# EAGLE design AK4493-Combi8 (EAGLE 9.6.2)
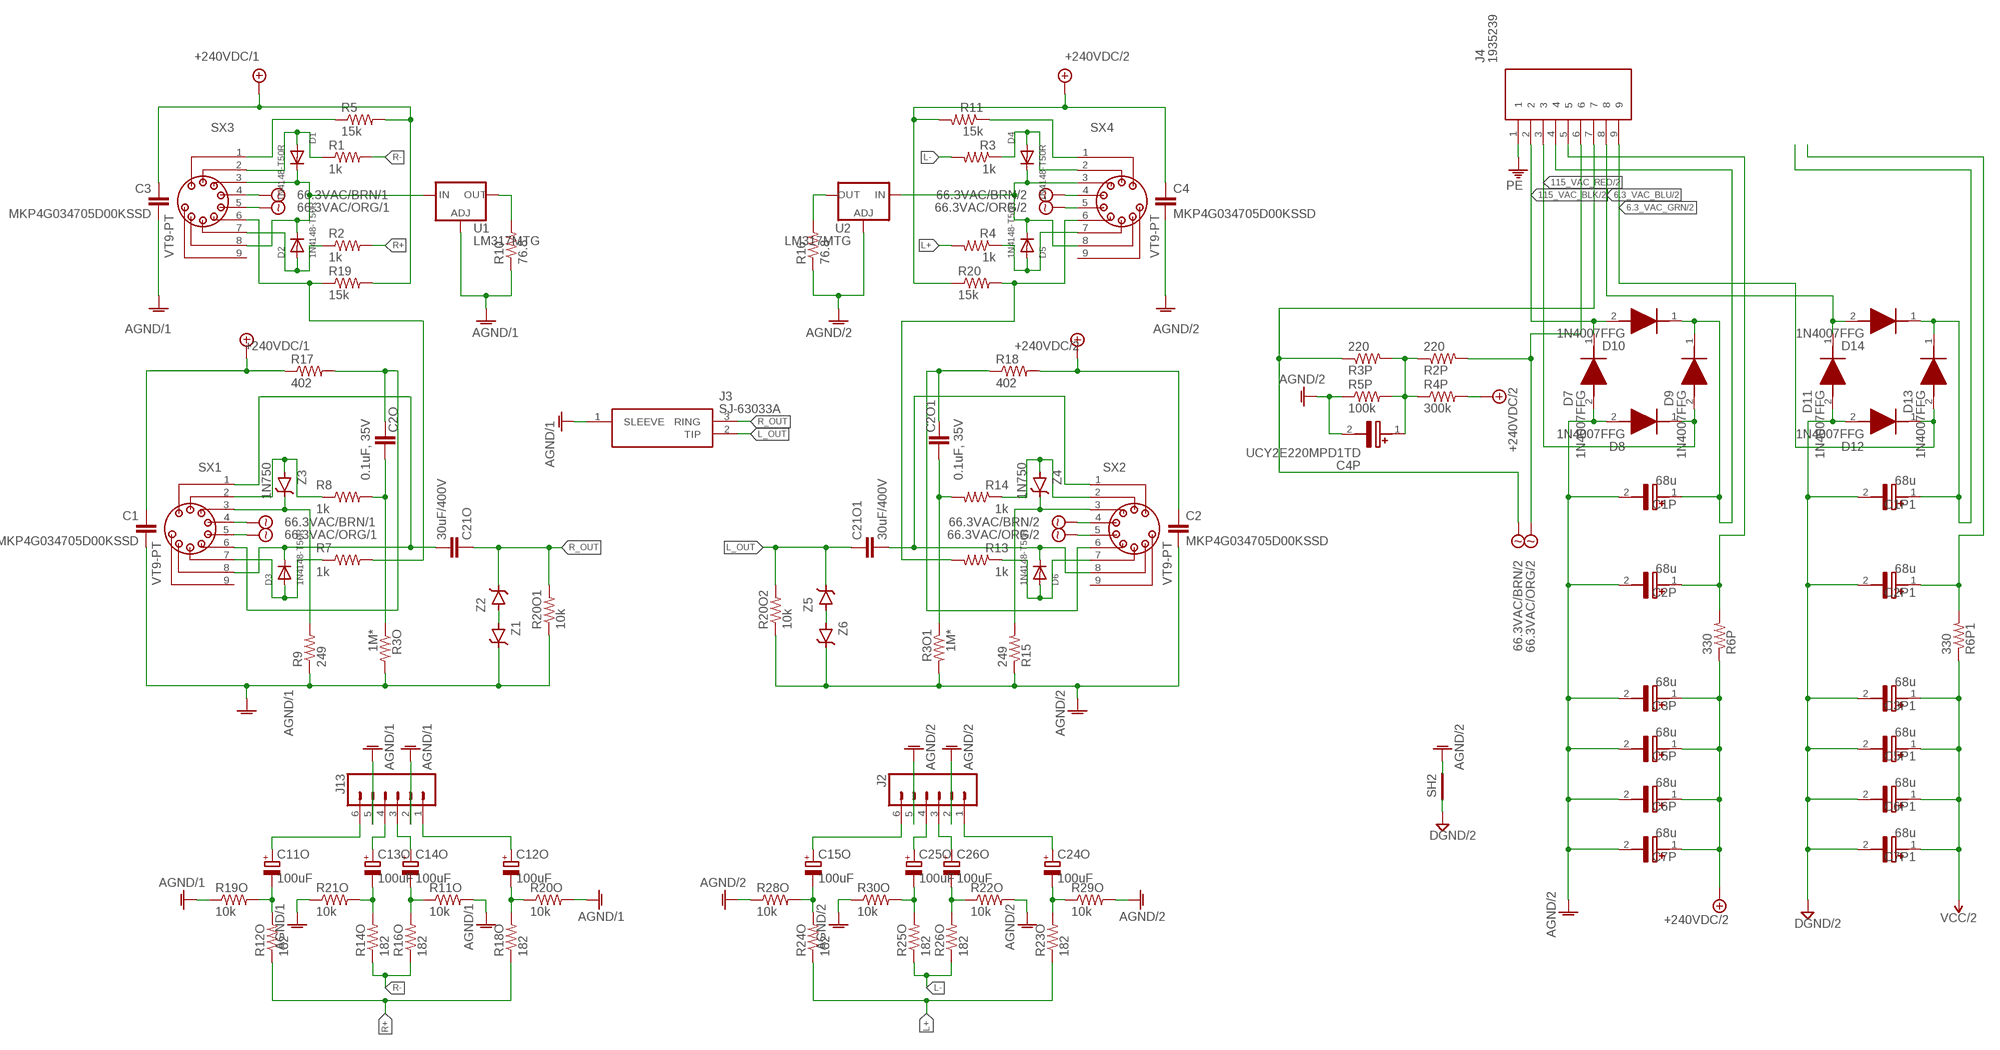
[diagram p0: schematic, sheet 1, part 1 of 2]
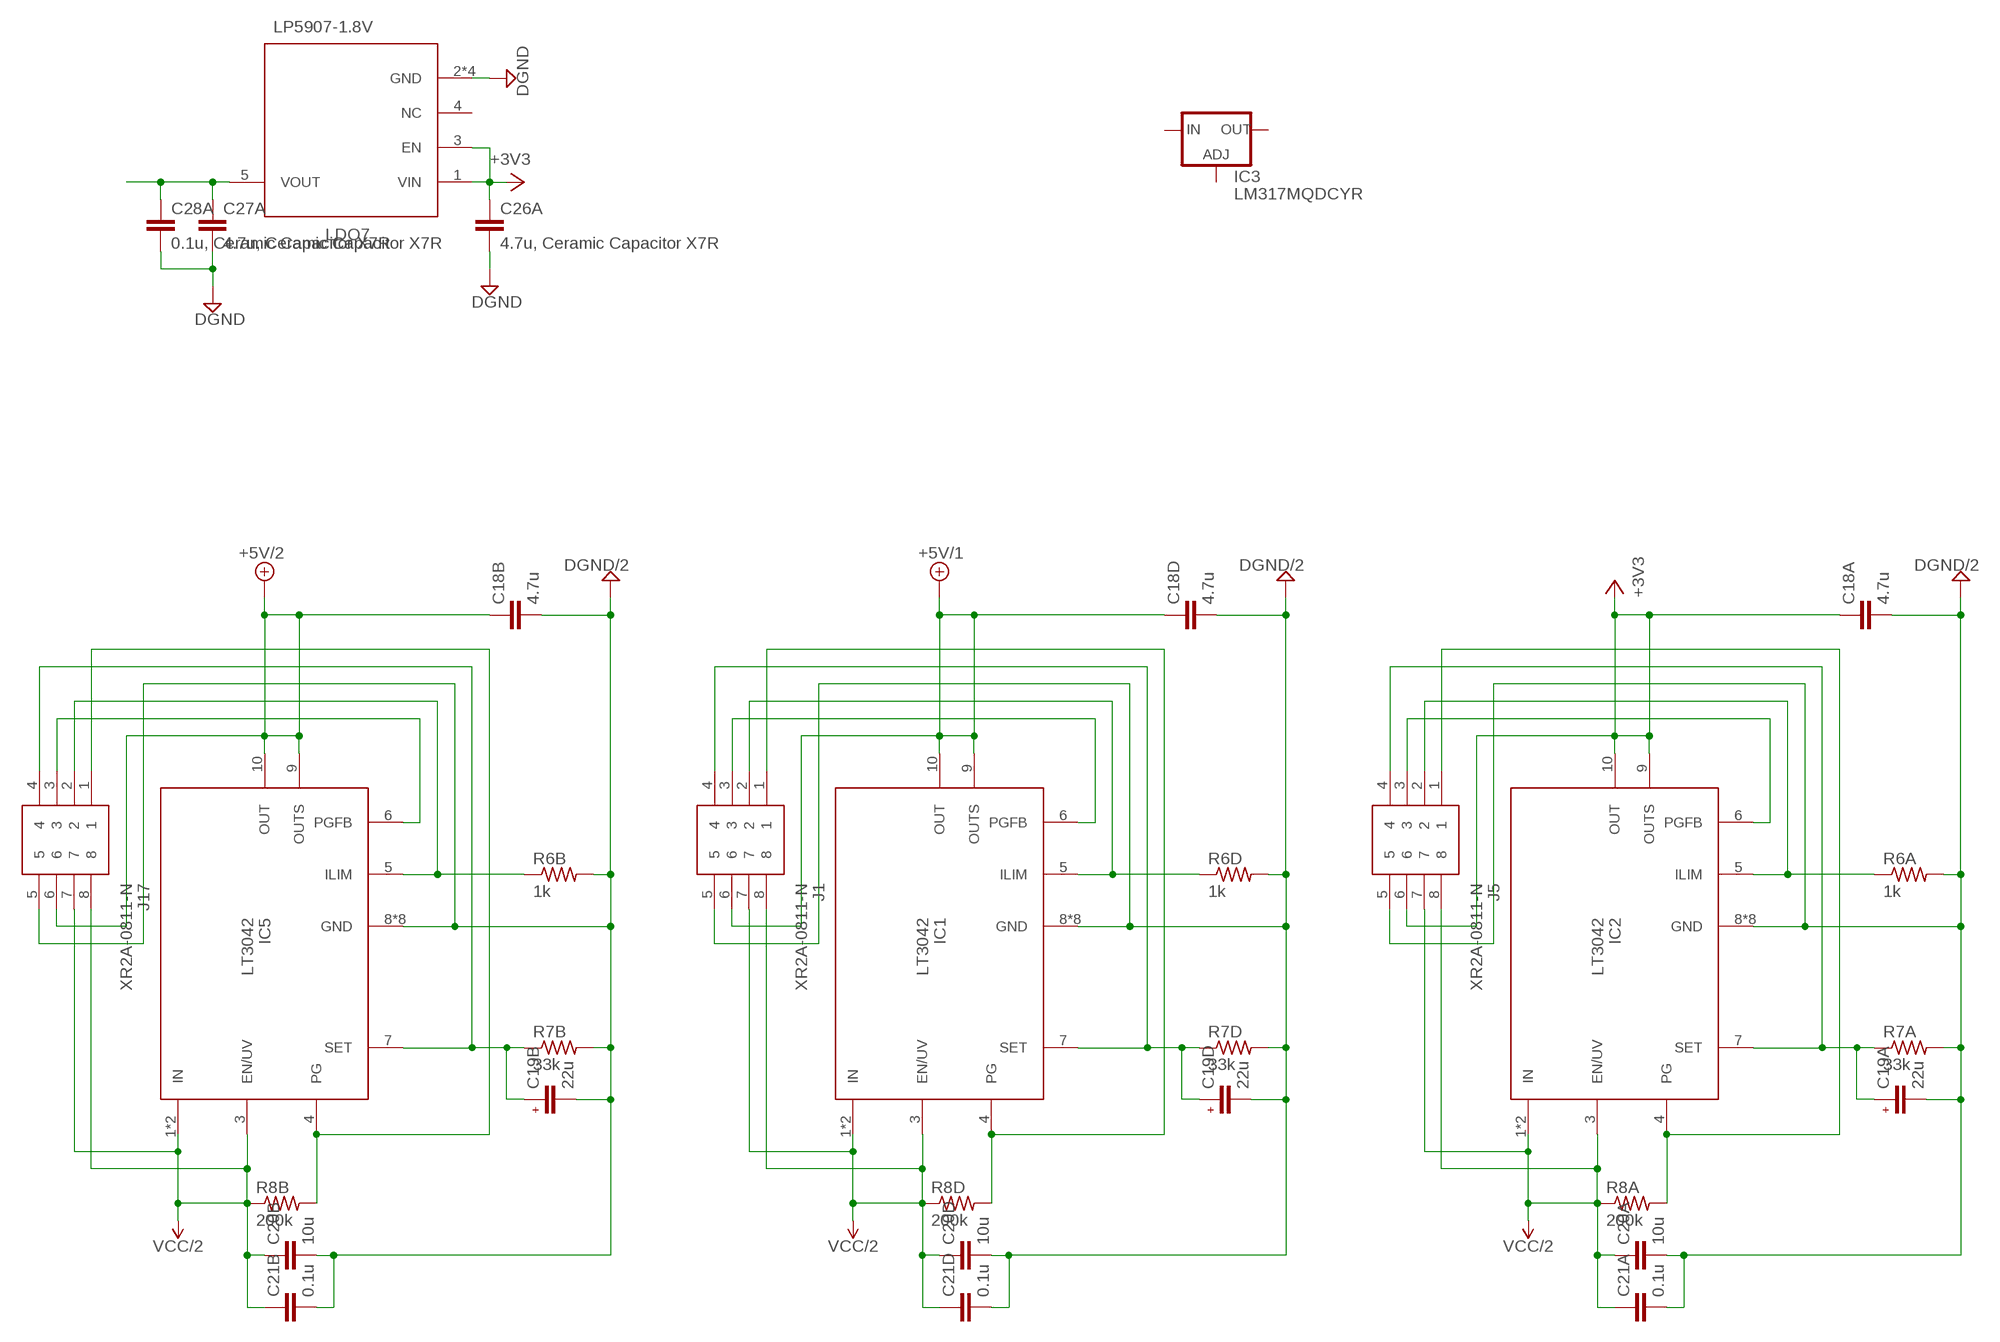
[diagram p1: schematic, sheet 1, part 2 of 2]

## Parts
C1  MKP4G034705D00KSSD  [MKP4G034705D00KSSD]
C1P  68u  500HXW68MEFR14.5X45  [CAPPRD750W80D1475H4700]
C1P1  68u  500HXW68MEFR14.5X45  [CAPPRD750W80D1475H4700]
C2  MKP4G034705D00KSSD  [MKP4G034705D00KSSD]
C2O  0.1uF, 35V  MKS4B031002A00JC00  [MKS4B031002A00JC00]
C2O1  0.1uF, 35V  MKS4B031002A00JC00  [MKS4B031002A00JC00]
C2P  68u  500HXW68MEFR14.5X45  [CAPPRD750W80D1475H4700]
C2P1  68u  500HXW68MEFR14.5X45  [CAPPRD750W80D1475H4700]
C3  MKP4G034705D00KSSD  [MKP4G034705D00KSSD]
C3P  68u  500HXW68MEFR14.5X45  [CAPPRD750W80D1475H4700]
C3P1  68u  500HXW68MEFR14.5X45  [CAPPRD750W80D1475H4700]
C4  MKP4G034705D00KSSD  [MKP4G034705D00KSSD]
C4P  UCY2E220MPD1TD  [CAPPRD500W60D1025H1750]
C5P  68u  500HXW68MEFR14.5X45  [CAPPRD750W80D1475H4700]
C5P1  68u  500HXW68MEFR14.5X45  [CAPPRD750W80D1475H4700]
C6P  68u  500HXW68MEFR14.5X45  [CAPPRD750W80D1475H4700]
C6P1  68u  500HXW68MEFR14.5X45  [CAPPRD750W80D1475H4700]
C7P  68u  500HXW68MEFR14.5X45  [CAPPRD750W80D1475H4700]
C7P1  68u  500HXW68MEFR14.5X45  [CAPPRD750W80D1475H4700]
C11O  100uF  UFW1H101MPD1TD  [CAPPRD350W60D825H1300]
C12O  100uF  UFW1H101MPD1TD  [CAPPRD350W60D825H1300]
C13O  100uF  UFW1H101MPD1TD  [CAPPRD350W60D825H1300]
C14O  100uF  UFW1H101MPD1TD  [CAPPRD350W60D825H1300]
C15O  100uF  UFW1H101MPD1TD  [CAPPRD350W60D825H1300]
C18A  4.7u  EMK212ABJ475KG-T  [CAPC2013X140N]
C18B  4.7u  EMK212ABJ475KG-T  [CAPC2013X140N]
C18D  4.7u  EMK212ABJ475KG-T  [CAPC2013X140N]
C19A  22u  EMK316BB7226ML-T  [C1206]
C19B  22u  EMK316BB7226ML-T  [C1206]
C19D  22u  EMK316BB7226ML-T  [C1206]
C20A  10u  EMK212BB7106KG-T  [CAPC2012X135N]
C20B  10u  EMK212BB7106KG-T  [CAPC2012X135N]
C20D  10u  EMK212BB7106KG-T  [CAPC2012X135N]
C21A  0.1u  EMF212B7104KGHT  [CAPC2012X135N]
C21B  0.1u  EMF212B7104KGHT  [CAPC2012X135N]
C21D  0.1u  EMF212B7104KGHT  [CAPC2012X135N]
C21O  30uF/400V  DCP4G056007GD4KSSD  [DCP4G056007GD4KSSD]
C21O1  30uF/400V  DCP4G056007GD4KSSD  [DCP4G056007GD4KSSD]
C24O  100uF  UFW1H101MPD1TD  [CAPPRD350W60D825H1300]
C25O  100uF  UFW1H101MPD1TD  [CAPPRD350W60D825H1300]
C26A  4.7u, Ceramic Capacitor X7R  EMK212ABJ475KG-T  [CAPC2013X140N]
C26O  100uF  UFW1H101MPD1TD  [CAPPRD350W60D825H1300]
C27A  4.7u, Ceramic Capacitor X7R  EMK212ABJ475KG-T  [CAPC2013X140N]
C28A  0.1u, Ceramic Capacitor X7R  EMF212B7104KGHT  [CAPC2012X135N]
D1  1N4148-T50R  [DIOAD1068W53L380D172]
D2  1N4148-T50R  [DIOAD1068W53L380D172]
D3  1N4148-T50R  [DIOAD1068W53L380D172]
D4  1N4148-T50R  [DIOAD1068W53L380D172]
D5  1N4148-T50R  [DIOAD1068W53L380D172]
D6  1N4148-T50R  [DIOAD1068W53L380D172]
D7  1N4007FFG  [DIOAD1405W86L465D235]
D8  1N4007FFG  [DIOAD1405W86L465D235]
D9  1N4007FFG  [DIOAD1405W86L465D235]
D10  1N4007FFG  [DIOAD1405W86L465D235]
D11  1N4007FFG  [DIOAD1405W86L465D235]
D12  1N4007FFG  [DIOAD1405W86L465D235]
D13  1N4007FFG  [DIOAD1405W86L465D235]
D14  1N4007FFG  [DIOAD1405W86L465D235]
IC1  LT3042  [SOP50P490X110-11N]
IC2  LT3042  [SOP50P490X110-11N]
IC3  LM317MQDCYR  [SOT230P700X180-4N]
IC5  LT3042  [SOP50P490X110-11N]
J1  XR2A-0811-N  [DIPS762W51P254L1016H390Q8N]
J2  CONN_06SILK_FEMALE_PTH  [1X06]
J3  SJ-63033A  [SJ63033A]
J4  1935239  [1935239]
J5  XR2A-0811-N  [DIPS762W51P254L1016H390Q8N]
J13  CONN_06SILK_FEMALE_PTH  [1X06]
J17  XR2A-0811-N  [DIPS762W51P254L1016H390Q8N]
LDO7  LP5907-1.8V  [SOT95P280X145-5N]
R1  1k  LR1F1K0  [0207/10]
R2  1k  LR1F1K0  [0207/10]
R2P  220  R-US_0411/15  [0411/15]
R3  1k  LR1F1K0  [0207/10]
R3O  1M*  LR1F1M0  [0207/10]
R3O1  1M*  LR1F1M0  [0207/10]
R3P  220  R-US_0411/15  [0411/15]
R4  1k  LR1F1K0  [0207/10]
R4P  300k  R-US_0411/15  [0411/15]
R5  15k  CPF215K000FKE14  [0411/15]
R5P  100k  R-US_0411/15  [0411/15]
R6A  1k  CHP0805-FX-1001ELF  [RESC2012X60N]
R6B  1k  CHP0805-FX-1001ELF  [RESC2012X60N]
R6D  1k  CHP0805-FX-1001ELF  [RESC2012X60N]
R6P  330  R-US_0411/15  [0411/15]
R6P1  330  R-US_0411/15  [0411/15]
R7  1k  LR1F1K0  [0207/10]
R7A  33k  CPF0805B51KE1  [R0805]
R7B  33k  CPF0805B51KE1  [R0805]
R7D  33k  CPF0805B51KE1  [R0805]
R8  1k  LR1F1K0  [0207/10]
R8A  200k  RR1220P-204-D  [R0805]
R8B  200k  RR1220P-204-D  [R0805]
R8D  200k  RR1220P-204-D  [R0805]
R9  249  MBB02070C2490FRP00  [0207/10]
R10  76.8  YR1B76R8CC  [0207/10]
R11  15k  CPF215K000FKE14  [0411/15]
R11O  10k  LR1F10K  [0207/10]
R12O  182  MF0207FTE52-182R  [0207/10]
R13  1k  LR1F1K0  [0207/10]
R14  1k  LR1F1K0  [0207/10]
R14O  182  MF0207FTE52-182R  [0207/10]
R15  249  MBB02070C2490FRP00  [0207/10]
R16  76.8  YR1B76R8CC  [0207/10]
R16O  182  MF0207FTE52-182R  [0207/10]
R17  402  RWR80S4020FRB12  [0617/22]
R18  402  RWR80S4020FRB12  [0617/22]
R18O  182  MF0207FTE52-182R  [0207/10]
R19  15k  CPF215K000FKE14  [0411/15]
R19O  10k  LR1F10K  [0207/10]
R20  15k  CPF215K000FKE14  [0411/15]
R20O  10k  LR1F10K  [0207/10]
R20O1  10k  LR1F10K  [0207/10]
R20O2  10k  LR1F10K  [0207/10]
R21O  10k  LR1F10K  [0207/10]
R22O  10k  LR1F10K  [0207/10]
R23O  182  MF0207FTE52-182R  [0207/10]
R24O  182  MF0207FTE52-182R  [0207/10]
R25O  182  MF0207FTE52-182R  [0207/10]
R26O  182  MF0207FTE52-182R  [0207/10]
R28O  10k  LR1F10K  [0207/10]
R29O  10k  LR1F10K  [0207/10]
R30O  10k  LR1F10K  [0207/10]
SH2  SHORTA5  [SHORT_ALL-50]
SX1  VT9-PT  [VT9-PT]
SX2  VT9-PT  [VT9-PT]
SX3  VT9-PT  [VT9-PT]
SX4  VT9-PT  [VT9-PT]
U1  LM317MTG  [TO254P482X997X2018-3P]
U2  LM317MTG  [TO254P482X997X2018-3P]
Z1  BZX79-C16,113  [DIOAD1165W56L425D185]
Z2  BZX79-C16,113  [DIOAD1165W56L425D185]
Z3  1N750  [DIOAD1256W56L444D203]
Z4  1N750  [DIOAD1256W56L444D203]
Z5  BZX79-C16,113  [DIOAD1165W56L425D185]
Z6  BZX79-C16,113  [DIOAD1165W56L425D185]

## Nets
6.3_VAC_BLU/2: D11.1(K) D14.2(A) J4.8
6.3_VAC_GRN/2: D12.1(K) D13.2(A) J4.9
66.3VAC/BRN/1: SX1.4 SX3.4
66.3VAC/BRN/2: J4.7 R3P.1 SX2.4 SX4.4
66.3VAC/ORG/1: SX1.5 SX3.5
66.3VAC/ORG/2: J4.6 R2P.2 SX2.5 SX4.5
115_VAC_BLK/2: D7.1(K) D10.2(A) J4.2
115_VAC_RED/2: D8.1(K) D9.2(A) J4.3
+3V3: C18A.1 C26A.1 IC2.9(OUTS) IC2.10(OUT) J5.6 LDO7.1(VIN) LDO7.3(EN)
+5V/1: C18D.1 IC1.9(OUTS) IC1.10(OUT) J1.6
+5V/2: C18B.1 IC5.9(OUTS) IC5.10(OUT) J17.6
+240VDC/1: C1.1 C3.1 R5.2 R17.1 R19.2
+240VDC/2: C2.1 C3P.1(+) C4.1 C5P.1(+) C6P.1(+) C7P.1(+) R4P.2 R6P.1 R11.2 R18.2 R20.1
AGND/1: C1.2 C3.2 J3.1(SLEEVE) J13.2 J13.5 R3O.2 R9.1 R10.1 R11O.2 R19O.1 R20O1.1 R20O.2 R21O.1 U1.1(ADJ) Z1.1(C)
AGND/2: C1P.2(-) C2.2 C2P.2(-) C3P.2(-) C4.2 C4P.2(-) C5P.2(-) C6P.2(-) C7P.2(-) D7.2(A) D8.2(A) J2.2 J2.5 R3O1.2 R5P.1 R15.1 R16.1 R20O2.1 R22O.2 R28O.1 R29O.2 R30O.1 SH2.2 U2.1(ADJ) Z6.1(C)
DGND: C26A.2 C27A.2 C28A.2 LDO7.2(GND) LDO7.DGND2(GND) LDO7.DGND3(GND) LDO7.DGND(GND)
DGND/2: C1P1.2(-) C2P1.2(-) C3P1.2(-) C5P1.2(-) C6P1.2(-) C7P1.2(-) C18A.2 C18B.2 C18D.2 C19A.2 C19A.DGND C19B.2 C19B.DGND C19D.2 C19D.DGND C20A.2 C20B.2 C20D.2 C21A.2 C21B.2 C21D.2 D11.2(A) D12.2(A) IC1.8(GND) IC1.11(GND) IC1.P$1(GND) IC1.P$2(GND) IC1.P$3(GND) IC1.P$4(GND) IC1.P$5(GND) IC1.P$6(GND) IC2.8(GND) IC2.11(GND) IC2.P$1(GND) IC2.P$2(GND) IC2.P$3(GND) IC2.P$4(GND) IC2.P$5(GND) IC2.P$6(GND) IC5.8(GND) IC5.11(GND) IC5.P$1(GND) IC5.P$2(GND) IC5.P$3(GND) IC5.P$4(GND) IC5.P$5(GND) IC5.P$6(GND) J1.5 J5.5 J17.5 R6A.2 R6B.2 R6D.2 R7A.2 R7B.2 R7D.2 SH2.1
L+ [Signal]: R4.2 R23O.1 R24O.1
L- [Signal]: R3.2 R25O.1 R26O.1
L_OUT [Signal]: C21O1.1 C21O1.4 J3.2(TIP) R20O2.2 Z5.1(C)
N$1: R7.2 R19.1 SX3.6
N$2: R8.1 SX1.2 Z3.2(A)
N$3: C21O1.2 C21O1.3 D6.1(C) SX2.1 SX2.8
N$4: D4.2(A) R3.1 SX4.2
N$5: D5.2(A) R4.1 SX4.7
N$6: D1.2(A) R1.1 SX3.2
N$7 [Power]: D4.1(C) D5.1(C) SX4.3 SX4.8 U2.3(IN)
N$8: R11.1 SX4.1
N$9: R13.2 R20.2 SX4.6
N$10: C11O.1(+) J13.6
N$11: C11O.2(-) R12O.2 R19O.2
N$12: C15O.1(+) J2.6
N$13: D2.2(A) R2.1 SX3.7
N$14: R14.1 SX2.2 Z4.2(A)
N$15: C12O.1(+) J13.1
N$16: C2O.2 R3O.1 R8.2
N$17: C2O1.2 R3O1.1 R14.2
N$18: C21O.2 C21O.3 D3.1(C) SX1.1 SX1.8
N$19: C12O.2(-) R18O.2 R20O.1
N$20: C15O.2(-) R24O.2 R28O.2
N$21: C13O.1(+) J13.4
N$22 [Power]: D1.1(C) D2.1(C) SX3.3 SX3.8 U1.3(IN)
N$23: D3.2(A) R7.1 SX1.7
N$24: C14O.1(+) J13.3
N$25: C14O.2(-) R11O.1 R16O.2
N$26: R9.2 SX1.3 Z3.1(C)
N$27: R15.2 SX2.3 Z4.1(C)
N$28: C13O.2(-) R14O.2 R21O.2
N$29: D6.2(A) R13.1 SX2.7
N$30: C24O.1(+) J2.1
N$31: C24O.2(-) R23O.2 R29O.1
N$32: C25O.1(+) J2.4
N$33: C26O.1(+) J2.3
N$34: C26O.2(-) R22O.1 R26O.2
N$35: R5.1 SX3.1
N$36: C25O.2(-) R25O.2 R30O.2
N$37: R10.2 U1.2(OUT)
N$38: R16.2 U2.2(OUT)
N$39 [Power]: C2O.1 R17.2 SX1.6
N$40 [Power]: C2O1.1 R18.1 SX2.6
N$41: Z1.2(A) Z2.2(A)
N$42: Z5.2(A) Z6.2(A)
N$43: C1P.1(+) D9.1(K) D10.1(K) J4.4
N$44: C2P.1(+) J4.5 R6P.2
N$45: C4P.1(+) R2P.1 R3P.2 R4P.1 R5P.2
N$46: IC5.4(PG) J17.1 R8B.2
N$47: IC5.5(ILIM) J17.2 R6B.1
N$48: IC5.6(PGFB) J17.3
N$49: IC1.4(PG) J1.1 R8D.2
N$50: IC1.5(ILIM) J1.2 R6D.1
N$51: IC1.6(PGFB) J1.3
N$52: C19D.1 IC1.7(SET) J1.4 R7D.1
N$53: IC2.4(PG) J5.1 R8A.2
N$54: IC2.5(ILIM) J5.2 R6A.1
N$55: IC2.6(PGFB) J5.3
N$56: C19A.1 IC2.7(SET) J5.4 R7A.1
N$57: C1P1.1(+) D13.1(K) D14.1(K)
N$58: C2P1.1(+) R6P1.2
N$65: C27A.1 C28A.1 LDO7.5(VOUT)
N$103: C19B.1 IC5.7(SET) J17.4 R7B.1
PE: J4.1
R+ [Signal]: R2.2 R12O.1 R18O.1
R- [Signal]: R1.2 R14O.1 R16O.1
R_OUT [Signal]: C21O.1 C21O.4 J3.3(RING) R20O1.2 Z2.1(C)
VCC/2: C3P1.1(+) C5P1.1(+) C6P1.1(+) C7P1.1(+) C20A.1 C20B.1 C20D.1 C21A.1 C21B.1 C21D.1 IC1.1(IN) IC1.2(IN) IC1.3(EN/UV) IC2.1(IN) IC2.2(IN) IC2.3(EN/UV) IC5.1(IN) IC5.2(IN) IC5.3(EN/UV) J1.7 J1.8 J5.7 J5.8 J17.7 J17.8 R6P1.1 R8A.1 R8B.1 R8D.1
Unconnected: IC3.1(ADJ) IC3.2(OUT) IC3.3(IN) IC3.4(OUT) LDO7.4(NC) SX1.9 SX2.9 SX3.9 SX4.9

## Library data of the parts
C1-C4 = Dual Mono Amp Library:MKP4G034705D00KSSD: 0.47 F Film Capacitor 220V 400V Polypropylene (PP), Metallized Radial Source: Datasheet <https://www.wima.de/wp-content/uploads/media/e_WIMA_MKP_4.pdf>; DESCRIPTION: 0.47 F Film Capacitor 220V 400V Polypropylene (PP), Metallized Radial; HEIGHT: 16.5mm; MANUFACTURER_NAME: WIMA; MANUFACTURER_PART_NUMBER: MKP4G034705D00KSSD; MOUSER_PART_NUMBER: 505-MKP4G034705DKSSD; MOUSER_PRICE-STOCK: http://www.mouser.com/Search/ProductDetail.aspx?qs=sJjjjplDs9uaOctv9bTMfA%3d%3d
C1P C1P1 C2P C2P1 C3P C3P1 C5P C5P1 C6P C6P1 C7P C7P1 = 500HXW68MEFR14.5X45:500HXW68MEFR14.5X45: Aluminum Electrolytic Capacitors - Radial Leaded GENERAL PURPOSE ELECTROLYTIC CAPACITORS Source: Datasheet <https://www.mouser.com/datasheet/2/977/e_HXW-1600623.pdf>; DESCRIPTION: Aluminum Electrolytic Capacitors - Radial Leaded GENERAL PURPOSE ELECTROLYTIC CAPACITORS; HEIGHT: 47mm; MANUFACTURER_NAME: Rubycon; MANUFACTURER_PART_NUMBER: 500HXW68MEFR14.5X45
C2O C2O1 = Dual Mono Amp Library:MKS4B031002A00JC00: Film Capacitors MKS 4 0.1 uF 50 VDC 2.5x7x10 PCM 7.5 Source: Datasheet <https://www.wima.de/wp-content/uploads/media/e_WIMA_MKS_4.pdf>; DESCRIPTION: Film Capacitors MKS 4 0.1 uF 50 VDC 2.5x7x10 PCM 7.5; HEIGHT: 7mm; MANUFACTURER_NAME: WIMA; MANUFACTURER_PART_NUMBER: MKS4B031002A00JC00; MOUSER_PART_NUMBER: 505-MKS4B0312AJC; MOUSER_PRICE-STOCK: https://www.mouser.co.uk/ProductDetail/WIMA/MKS4B031002A00JC00?qs=2G4irm%2FqADy9MV8AUfKNYA%3D%3D
C4P = UCY2E220MPD1TD:UCY2E220MPD1TD: Aluminum Electrolytic Capacitors - Radial Leaded 22uF 250V 20% AEC-Q200 Source: Datasheet <https://www.mouser.in/datasheet/2/293/e_ucy-3082387.pdf>; DESCRIPTION: Aluminum Electrolytic Capacitors - Radial Leaded 22uF 250V 20% AEC-Q200; HEIGHT: 17.5mm; MANUFACTURER_NAME: Nichicon; MANUFACTURER_PART_NUMBER: UCY2E220MPD1TD; MOUSER_PART_NUMBER: 647-UCY2E220MPD1TD; MOUSER_PRICE-STOCK: https://www.mouser.co.uk/ProductDetail/Nichicon/UCY2E220MPD1TD?qs=JgOBn5pVFooNXIGMeLbPFg%3D%3D
C11O C12O C13O C14O C15O C24O C25O C26O = Dual Mono Amp Library:UFW1H101MPD1TD: Aluminum Electrolytic Capacitors - Radial Leaded 100uF 50 Volts 20% Source: Datasheet <https://www.nichicon.co.jp/english/series_items/catalog_pdf/e-ufw.pdf>; ARROW_PART_NUMBER: UFW1H101MPD1TD; ARROW_PRICE-STOCK: https://www.arrow.com/en/products/ufw1h101mpd1td/nichicon; DESCRIPTION: Aluminum Electrolytic Capacitors - Radial Leaded 100uF 50 Volts 20%; HEIGHT: 13mm; MANUFACTURER_NAME: Nichicon; MANUFACTURER_PART_NUMBER: UFW1H101MPD1TD; MOUSER_PART_NUMBER: 647-UFW1H101MPD1TD; MOUSER_PRICE-STOCK: https://www.mouser.co.uk/ProductDetail/Nichicon/UFW1H101MPD1TD?qs=WJSLByB5Mu30jPPJ2KiG3A%3D%3D
C18A C18B C18D C26A C27A = Dual Mono Amp Library:EMK212ABJ475KG-T: Taiyo Yuden 4.7uF Multilayer Ceramic Capacitor MLCC 16V dc +/-10% X5R Dielectric 0805 SMD, Max. Temp. +85C Source: Datasheet <https://datasheet.datasheetarchive.com/originals/distributors/DKDS-8/141347.pdf>; DESCRIPTION: Taiyo Yuden 4.7uF Multilayer Ceramic Capacitor MLCC 16V dc +/-10% X5R Dielectric 0805 SMD, Max. Temp. +85C; HEIGHT: 1.4mm; MANUFACTURER_NAME: TAIYO YUDEN; MANUFACTURER_PART_NUMBER: EMK212ABJ475KG-T; MOUSER_PART_NUMBER: 963-EMK212ABJ475KG-T; MOUSER_PRICE-STOCK: https://www.mouser.co.uk/ProductDetail/Taiyo-Yuden/EMK212ABJ475KG-T?qs=Va%252BXcMGJzEtDqSLhA2RQmA%3D%3D
C19A C19B C19D = Dual Mono Amp Library:EMK316BB7226ML-T: Multilayer Ceramic Capacitors MLCC - SMD/SMT 22uF 16V X7R +/-20% 1206 Gen Purp Source: Datasheet <https://componentsearchengine.com/Datasheets/1/EMK316BB7226ML-T.pdf>; DESCRIPTION: Multilayer Ceramic Capacitors MLCC - SMD/SMT 22uF 16V X7R +/-20% 1206 Gen Purp; HEIGHT: 1.8mm; MANUFACTURER_NAME: TAIYO YUDEN; MANUFACTURER_PART_NUMBER: EMK316BB7226ML-T; MOUSER_PART_NUMBER: 963-EMK316BB7226ML-T; MOUSER_PRICE-STOCK: https://www.mouser.co.uk/ProductDetail/TAIYO-YUDEN/EMK316BB7226ML-T?qs=EPmvyOv1YlPvyo1ebMxtFg%3D%3D
C20A C20B C20D = Dual Mono Amp Library:EMK212BB7106KG-T: Multilayer Ceramic Capacitors MLCC - SMD/SMT 10uF 16V X7R 10% 0805 Source: Datasheet; DESCRIPTION: Multilayer Ceramic Capacitors MLCC - SMD/SMT 10uF 16V X7R 10% 0805; HEIGHT: 1.35mm; MANUFACTURER_NAME: TAIYO YUDEN; MANUFACTURER_PART_NUMBER: EMK212BB7106KG-T; MOUSER_PART_NUMBER: 963-EMK212BB7106KG-T; MOUSER_PRICE-STOCK: https://www.mouser.co.uk/ProductDetail/TAIYO-YUDEN/EMK212BB7106KG-T?qs=vF%252B8ahGVilemLVRka0hELA%3D%3D
C21A C21B C21D C28A = Dual Mono Amp Library:EMF212B7104KGHT: Multilayer Ceramic Capacitors MLCC - SMD/SMT 0805 16VDC 0.1uF 10% X7R AEC-Q200 Source: Datasheet <https://www.mouser.sg/ProductDetail/Taiyo-Yuden/EMF212B7104KGHT?qs=sGAEpiMZZMsh%2B1woXyUXj3/0vCYPokIk61QdMFnXOfA=>; DESCRIPTION: Multilayer Ceramic Capacitors MLCC - SMD/SMT 0805 16VDC 0.1uF 10% X7R AEC-Q200; HEIGHT: 1.35mm; MANUFACTURER_NAME: TAIYO YUDEN; MANUFACTURER_PART_NUMBER: EMF212B7104KGHT; MOUSER_PART_NUMBER: 963-EMF212B7104KGHT; MOUSER_PRICE-STOCK: https://www.mouser.co.uk/ProductDetail/Taiyo-Yuden/EMF212B7104KGHT?qs=%252B6g0mu59x7JRGtoE3odDgw%3D%3D
C21O C21O1 = Dual Mono Amp Library:DCP4G056007GD4KSSD: Metallized Polypropylene Capacitor Source: Datasheet <https://www.mouser.in/datasheet/2/440/e_WIMA_DC_Link_MKP_4-1139924.pdf>; DESCRIPTION: Metallized Polypropylene Capacitor; HEIGHT: 39.5mm; MANUFACTURER_NAME: WIMA; MANUFACTURER_PART_NUMBER: DCP4G056007GD4KSSD; MOUSER_PART_NUMBER: 505-DCP4G056007GD4KS; MOUSER_PRICE-STOCK: https://www.mouser.co.uk/ProductDetail/WIMA/DCP4G056007GD4KSSD?qs=RB4whv9F6ryIMjVzuPTkgw%3D%3D
D1-D6 = Dual Mono Amp Library:1N4148-T50R: Diodes - General Purpose, Power, Switching Hi Conductance Fast Source: Datasheet <https://www.onsemi.com/pub/Collateral/1N914-D.PDF>; DESCRIPTION: Diodes - General Purpose, Power, Switching Hi Conductance Fast; HEIGHT: mm; MANUFACTURER_NAME: onsemi; MANUFACTURER_PART_NUMBER: 1N4148-T50R; MOUSER_PART_NUMBER: 512-1N4148T50R; MOUSER_PRICE-STOCK: https://www.mouser.co.uk/ProductDetail/onsemi-Fairchild/1N4148-T50R?qs=0lQeLiL1qyZS6rosZp7Ehg%3D%3D
D7-D14 = 1N4007FFG:1N4007FFG: Rectifiers 1000V 1A Standard Source: Datasheet <http://www.onsemi.com/pub_link/Collateral/1N4001-D.PDF>; DESCRIPTION: Rectifiers 1000V 1A Standard; HEIGHT: mm; MANUFACTURER_NAME: onsemi; MANUFACTURER_PART_NUMBER: 1N4007FFG; MOUSER_PART_NUMBER: 863-1N4007FFG; MOUSER_PRICE-STOCK: https://www.mouser.co.uk/ProductDetail/onsemi/1N4007FFG?qs=y2kkmE52mdPFE87Rxbyfgw%3D%3D
IC1 IC2 IC5 = Dual Mono Amp Library:LT3042: LINEAR TECHNOLOGY - LT3042EMSE#PBF - LDO, ADJ, 0.2A, 0V-15V, MSOP-10 Source: Datasheet <http://www.linear.com/docs/46159>; DESCRIPTION: LINEAR TECHNOLOGY - LT3042EMSE#PBF - LDO, ADJ, 0.2A, 0V-15V, MSOP-10; HEIGHT: 1.1mm; MANUFACTURER_NAME: Linear Technology; MANUFACTURER_PART_NUMBER: LT3042EMSE#PBF; MOUSER_PART_NUMBER: 584-LT3042EMSE#PBF; MOUSER_PRICE-STOCK: https://www.mouser.co.uk/ProductDetail/Analog-Devices-Linear-Technology/LT3042EMSEPBF?qs=oahfZPh6IAJ3XP16d20ITw%3D%3D
IC3 = Dual Mono Amp Library:LM317MQDCYR: Standard Regulator 1.25V to 37V 0.5A Texas Instruments LM317MQDCYR, Single Linear Voltage Regulator, 500mA Adjustable 1.25 37 V, 4-Pin SOT-223 Source: Datasheet <https://componentsearchengine.com/Datasheets/2/LM317MQDCYR.pdf>; DESCRIPTION: Standard Regulator 1.25V to 37V 0.5A Texas Instruments LM317MQDCYR, Single Linear Voltage Regulator, 500mA Adjustable 1.25 37 V, 4-Pin SOT-223; HEIGHT: 1.8mm; MANUFACTURER_NAME: Texas Instruments; MANUFACTURER_PART_NUMBER: LM317MQDCYR; MOUSER_PART_NUMBER: 595-LM317MQDCYR; MOUSER_PRICE-STOCK: https://www.mouser.co.uk/ProductDetail/Texas-Instruments/LM317MQDCYR?qs=VBduBm9rCJSAPGr9YDjocQ%3D%3D
J1 J5 J17 = XR2A-0811-N:XR2A-0811-N: IC & Component Sockets Socket DIP Term 8P 7.62mm .25AuPlate Source: Datasheet <https://omronfs.omron.com/en_US/ecb/products/pdf/en-xr2.pdf>; ARROW_PART_NUMBER: XR2A-0811-N; ARROW_PRICE-STOCK: https://www.arrow.com/en/products/xr2a-0811-n/omron?region=nac; DESCRIPTION: IC & Component Sockets Socket DIP Term 8P 7.62mm .25AuPlate; HEIGHT: 3.9mm; MANUFACTURER_NAME: Omron Electronics; MANUFACTURER_PART_NUMBER: XR2A-0811-N; MOUSER_PART_NUMBER: 653-XR2A-0811-N; MOUSER_PRICE-STOCK: https://www.mouser.co.uk/ProductDetail/Omron-Electronics/XR2A-0811-N?qs=WOBxwZpV8jWLu7CcbwkK0Q%3D%3D
J2 J13 = Dual Mono Amp Library:CONN_06: Multi connection point. Often used as Generic Header-pin footprint for 0.1 inch spaced/style header connections On any of the 0.1 inch spaced packages, you can populate with these: Break Away Headers - Straight <https://www.sparkfun.com/products/116> (PRT-00116) Break Away Male Headers - Right Angle <https://www.sparkfun.com/products/553> (PRT-00553) Female Headers <https://www.sparkfun.com/products/115> (PRT-00115) Break Away Headers - Machine Pin <https://www.sparkfun.com/products/117> (PRT-00117) Break Away Female Headers - Swiss Machine Pin <https://www.sparkfun.com/products/743> (PRT-00743) Arduino Stackable Header - 6 Pin <https://www.sparkfun.com/products/9280> (PRT-09280) Screw Terminals 2.54mm Pitch (6-Pin) <https://www.sparkfun.com/products/16499> (PRT-16499) For SCREWTERMINALS and SPRING TERMINALS visit here: Screw Terimnals on SparkFun.com <https://www.sparkfun.com/search/results?term=Screw+Terminals> (5mm/3.5mm/2.54mm spacing) This device is also useful as a general connection point to wire up your design to another part of your project. Our various solder wires solder well into these plated through hole pads. Hook-Up Wire - Assortment (Stranded, 22 AWG) <https://www.sparkfun.com/products/11375> (PRT-11375) Hook-Up Wire - Assortment (Solid Core, 22 AWG) <https://www.sparkfun.com/products/11367> (PRT-11367) View the entire wire category on our website here <https://www.sparkfun.com/categories/141>; PROD_ID: CONN-08437
J3 = Dual Mono Amp Library:SJ-63033A: 6.35 mm, Stereo, Right Angle, Through Hole Mount, 3 Conductors, 0 Internal Switches, Audio Jack Connector Source: Datasheet <https://www.cuidevices.com/product/resource/sj-63033a.pdf>; DESCRIPTION: 6.35 mm, Stereo, Right Angle, Through Hole Mount, 3 Conductors, 0 Internal Switches, Audio Jack Connector; HEIGHT: 12.3mm; MANUFACTURER_NAME: CUI Devices; MANUFACTURER_PART_NUMBER: SJ-63033A
J4 = Dual Mono Amp Library:1935239: Fixed Terminal Blocks PT 1.5/9-5.0-H Source: Datasheet <https://datasheet.datasheetarchive.com/originals/distributors/SFDatasheet-2/sf-00057466.pdf>; DESCRIPTION: Fixed Terminal Blocks PT 1.5/9-5.0-H; HEIGHT: 11.55mm; MANUFACTURER_NAME: Phoenix Contact; MANUFACTURER_PART_NUMBER: 1935239; MOUSER_PART_NUMBER: 651-1935239; MOUSER_PRICE-STOCK: https://www.mouser.co.uk/ProductDetail/Phoenix-Contact/1935239?qs=wd%252Bw3mUqFrmT9OXJ18dxCA%3D%3D
LDO7 = Dual Mono Amp Library:LP5907-1.8V: 250-mA ultra-low-noise low-IQ low-dropout (LDO) linear regulator Source: Datasheet <http://www.ti.com/lit/gpn/lp5907>; ARROW_PART_NUMBER: LP5907MFX-1.8/NOPB; ARROW_PRICE-STOCK: https://www.arrow.com/en/products/lp5907mfx-1.8nopb/texas-instruments?region=nac; DESCRIPTION: 250-mA ultra-low-noise low-IQ low-dropout (LDO) linear regulator; HEIGHT: 1.45mm; MANUFACTURER_NAME: Texas Instruments; MANUFACTURER_PART_NUMBER: LP5907MFX-1.8/NOPB; MOUSER_PART_NUMBER: 595-LP5907MFX-1.8NPB; MOUSER_PRICE-STOCK: https://www.mouser.co.uk/ProductDetail/Texas-Instruments/LP5907MFX-1.8-NOPB?qs=biyDIajrTn5jh5ArkSZeqw%3D%3D
R1-R4 R7 R8 R13 R14 = Dual Mono Amp Library:LR1F1K0: Body Features: Lead Type Axial-Leaded | Configuration Features: Number of Resistors 1 | Dimensions: Passive Component Dimensions 6.2 x 2.3 MM | Electrical Characteristics: Passive Component Tolerance 1 PCT | Resistance Value 1K OHM | Operating Voltage 350 V | Power Rating .6 WATT | Resistance Class 1k 1M | Packaging Features: Packaging Method Ammo Packed | Product Type Features: Element Type Thin Film | Resistor Type General Purpose Resistor | Termination Features: Termination Area Base Material Cop Source: Datasheet <https://www.te.com/commerce/DocumentDelivery/DDEController?Action=srchrtrv&DocNm=1773241&DocType=Data Sheet&DocLang=English&PartCntxt=1622349-1&DocFormat=pdf>; DESCRIPTION: Body Features: Lead Type Axial-Leaded | Configuration Features: Number of Resistors 1 | Dimensions: Passive Component Dimensions 6.2 x 2.3 MM | Electrical Characteristics: Passive Component Tolerance 1 PCT | Resistance Value 1K OHM | Operating Voltage 350 V | Power Rating .6 WATT | Resistance Class 1k 1M | Packaging Features: Packaging Method Ammo Packed | Product Type Features: Element Type Thin Film | Resistor Type General Purpose Resistor | Termination Features: Termination Area Base Material Cop; HEIGHT: mm; MANUFACTURER_NAME: TE Connectivity; MANUFACTURER_PART_NUMBER: LR1F1K0; MOUSER_PART_NUMBER: 279-LR1F1K0; MOUSER_PRICE-STOCK: https://www.mouser.co.uk/ProductDetail/TE-Connectivity-Holsworthy/LR1F1K0?qs=ip69W3eHERVhMxNSZkerTg%3D%3D
R2P R3P R4P R5P R6P R6P1 = rcl:R-US_: RESISTOR, American symbol; SPICEPREFIX: R
R3O R3O1 = Dual Mono Amp Library:LR1F1M0: TE Connectivity Axial Metal Film Resistor 1m +/-1% 0.6W +/-50ppm/C Source: Datasheet <https://www.te.com/commerce/DocumentDelivery/DDEController?Action=showdoc&DocId=Data Sheet1773241GpdfEnglishENG_DS_1773241_G.pdf1622367-1>; DESCRIPTION: TE Connectivity Axial Metal Film Resistor 1m +/-1% 0.6W +/-50ppm/C; HEIGHT: mm; MANUFACTURER_NAME: TE Connectivity; MANUFACTURER_PART_NUMBER: LR1F1M0; MOUSER_PART_NUMBER: 279-LR1F1M0; MOUSER_PRICE-STOCK: https://www.mouser.co.uk/ProductDetail/TE-Connectivity-Holsworthy/LR1F1M0?qs=ip69W3eHERVt%2FmQVAugcSg%3D%3D
R5 R11 R19 R20 = Dual Mono Amp Library:CPF215K000FKE14: VISHAY - CPF215K000FKE14 - Through Hole Resistor, 15 kohm, CPF Series, 2 W, +/- 1%, Axial Leaded, 500 V Source: Datasheet <https://www.vishay.com/doc?31021>; DESCRIPTION: VISHAY - CPF215K000FKE14 - Through Hole Resistor, 15 kohm, CPF Series, 2 W, +/- 1%, Axial Leaded, 500 V; HEIGHT: mm; MANUFACTURER_NAME: Vishay; MANUFACTURER_PART_NUMBER: CPF215K000FKE14; MOUSER_PART_NUMBER: 71-CPF2-F-15K-E3; MOUSER_PRICE-STOCK: https://www.mouser.com/ProductDetail/71-CPF2-F-15K-E3
R6A R6B R6D = Dual Mono Amp Library:CHP0805-FX-1001ELF: BOURNS - CHP0805-FX-1001ELF - SMD Chip Resistor, 0805 [2012 Metric], 1 kohm, CHP Series, 200 V, Thick Film, 500 mW Source: Datasheet <https://www.bourns.com/docs/product-datasheets/chp.pdf>; DESCRIPTION: BOURNS - CHP0805-FX-1001ELF - SMD Chip Resistor, 0805 [2012 Metric], 1 kohm, CHP Series, 200 V, Thick Film, 500 mW; HEIGHT: 0.6mm; MANUFACTURER_NAME: Bourns; MANUFACTURER_PART_NUMBER: CHP0805-FX-1001ELF; MOUSER_PART_NUMBER: 652-CHP0805FX1001ELF; MOUSER_PRICE-STOCK: https://www.mouser.co.uk/ProductDetail/Bourns/CHP0805-FX-1001ELF?qs=lc2O%252BfHJPVYkHmuBCgSoNQ%3D%3D
R7A R7B R7D = Dual Mono Amp Library:CPF0805B51KE1: NEOHM - TE CONNECTIVITY - CPF0805B51KE1 - SMD Chip Resistor, 51 kohm, +/- 0.1%, 100 mW, 0805 [2012 Metric], Thin Film, Precision Low TCR Source: Datasheet; DESCRIPTION: NEOHM - TE CONNECTIVITY - CPF0805B51KE1 - SMD Chip Resistor, 51 kohm, +/- 0.1%, 100 mW, 0805 [2012 Metric], Thin Film, Precision Low TCR; HEIGHT: 0.65mm; MANUFACTURER_NAME: TE Connectivity; MANUFACTURER_PART_NUMBER: CPF0805B51KE1; MOUSER_PART_NUMBER: 279-CPF0805B51KE1; MOUSER_PRICE-STOCK: https://www.mouser.co.uk/ProductDetail/TE-Connectivity-Holsworthy/CPF0805B51KE1?qs=iJVBkmKXgrkfOCLIw017vA%3D%3D
R8A R8B R8D = Dual Mono Amp Library:RR1220P-204-D: RESISTOR, 0805 200 KOhm +/- 0.5% 0.1 W Source: Datasheet <https://componentsearchengine.com/Datasheets/1/RR1220P-204-D.pdf>; DESCRIPTION: RESISTOR, 0805 200 KOhm +/- 0.5% 0.1 W; HEIGHT: mm; MANUFACTURER_NAME: Susumu; MANUFACTURER_PART_NUMBER: RR1220P-204-D; MOUSER_PART_NUMBER: 754-RR1220P-204D; MOUSER_PRICE-STOCK: https://www.mouser.com/Search/Refine.aspx?Keyword=754-RR1220P-204D
R9 R15 = Dual Mono Amp Library:MBB02070C2490FRP00: Metal Film Resistors - Through Hole 249ohm 1% 0.6W Metal Film Resistor Source: Datasheet; DESCRIPTION: Metal Film Resistors - Through Hole 249ohm 1% 0.6W Metal Film Resistor; HEIGHT: mm; MANUFACTURER_NAME: VISHAY; MANUFACTURER_PART_NUMBER: MBB02070C2490FRP00
R10 R16 = Dual Mono Amp Library:YR1B76R8CC: Body Features: Lead Type Axial-Leaded | Configuration Features: Number of Resistors 1 | Dimensions: Passive Component Dimensions 6.3 x 2.3 MM | Electrical Characteristics: Resistance Class Up to 1k | Power Rating .25 WATT | Operating Voltage 250 V | Passive Component Tolerance .1 PCT | Resistance Value 76.8 OHM | Packaging Features: Packaging Method Ammo Packed | Product Type Features: Resistor Type Precision Resistor | Element Type Thin Film | Termination Features: Number of Terminations 2 | Termination Source: Datasheet <https://www.te.com/commerce/DocumentDelivery/DDEController?Action=srchrtrv&DocNm=1309350_PASSIVE_COMPONENT&DocType=Catalog Section&DocLang=English&PartCntxt=2-1879027-1&DocFormat=pdf>; DESCRIPTION: Body Features: Lead Type Axial-Leaded | Configuration Features: Number of Resistors 1 | Dimensions: Passive Component Dimensions 6.3 x 2.3 MM | Electrical Characteristics: Resistance Class Up to 1k | Power Rating .25 WATT | Operating Voltage 250 V | Passive Component Tolerance .1 PCT | Resistance Value 76.8 OHM | Packaging Features: Packaging Method Ammo Packed | Product Type Features: Resistor Type Precision Resistor | Element Type Thin Film | Termination Features: Number of Terminations 2 | Termination; HEIGHT: mm; MANUFACTURER_NAME: TE Connectivity; MANUFACTURER_PART_NUMBER: YR1B76R8CC
R11O R19O R20O R20O1 R20O2 R21O R22O R28O R29O R30O = Dual Mono Amp Library:LR1F10K: Metal film resistor, 10K 0.6W TE Connectivity LR1F Series Axial Metal Film Resistor 10k Source: Datasheet <https://datasheet.datasheetarchive.com/originals/distributors/DKDS-21/401716.pdf>; DESCRIPTION: Metal film resistor, 10K 0.6W TE Connectivity LR1F Series Axial Metal Film Resistor 10k; HEIGHT: mm; MANUFACTURER_NAME: TE Connectivity; MANUFACTURER_PART_NUMBER: LR1F10K; MOUSER_PART_NUMBER: 279-LR1F10K; MOUSER_PRICE-STOCK: https://www.mouser.co.uk/ProductDetail/TE-Connectivity-Holsworthy/LR1F10K?qs=ip69W3eHERWDLLWs2Qv0Lg%3D%3D
R12O R14O R16O R18O R23O R24O R25O R26O = Dual Mono Amp Library:MF0207FTE52-182R: Metal Film Resistors - Through Hole 0.6W 1% 182 ohm 50pp m Source: Datasheet <https://www.mouser.com/datasheet/2/447/YAGEO_MF0_datasheet_2021v1-3003020.pdf>; DESCRIPTION: Metal Film Resistors - Through Hole 0.6W 1% 182 ohm 50pp m; HEIGHT: mm; MANUFACTURER: Yageo; MANUFACTURER_PART_NUMBER: MF0207FTE52-182R; MOUSER_PART_NUMBER: 603-MF0207FTE52-182R; MOUSER_PRICE-STOCK: https://www.mouser.com/ProductDetail/YAGEO/MF0207FTE52-182R?qs=KUIzHt%2Fe91leK267FaM40g%3D%3D
R17 R18 = Dual Mono Amp Library:RWR80S4020FRB12: Metal Film Resistors - Through Hole 402 OHM 2W 1% Source: Datasheet; DESCRIPTION: Metal Film Resistors - Through Hole 402 OHM 2W 1%; HEIGHT: mm; MANUFACTURER_NAME: VISHAY; MANUFACTURER_PART_NUMBER: RWR80S4020FRB12
SH2 = Dual Mono Amp Library:SHORT: Short between two nets; BOM: No; DESCRIPTION: Short between two nets
SX1-SX4 = Dual Mono Amp Library:VT9: VACUUM TUBE SOCKET Source: 00004280-VT9-PT.pdf
U1 U2 = Dual Mono Amp Library:LM317MTG: Internal Short Circuit Current Limiting; Internal Thermal Overload Protection; Output Current in Excess of 500 mA; Output Transistor Safe-Area Compensation; Output Adjustable between 1.2 V and 37 V; Floating Operation for High Voltage Applications; Eliminates Stocking Many Fixed Voltages; Pb-Free Packages are Available; NCV Prefix for Automotive and Other Applications Requiring Site Control Changes Source: Datasheet <https://www.onsemi.com/pub/Collateral/LM317M-D.PDF>; DESCRIPTION: Internal Short Circuit Current Limiting, Internal Thermal Overload Protection, Output Current in Excess of 500 mA, Output Transistor Safe-Area Compensation, Output Adjustable between 1.2 V and 37 V, Floating Operation for High Voltage Applications, Pb-Free Packages are Available; HEIGHT: 4.82mm; MANUFACTURER_NAME: onsemi; MANUFACTURER_PART_NUMBER: LM317MTG; MOUSER_PART_NUMBER: 863-LM317MTG; MOUSER_PRICE-STOCK: https://www.mouser.co.uk/ProductDetail/onsemi/LM317MTG?qs=2OtswVQKCOHbXYkL9fERIw%3D%3D
Z1 Z2 Z5 Z6 = Dual Mono Amp Library:BZX79-C16,113: Nexperia Zener Diode, 16V +/-2 %, +/-5 % 500 mW Through Hole 2-Pin SOD27 (DO-35) Source: Datasheet <https://assets.nexperia.com/documents/data-sheet/BZX79.pdf>; DESCRIPTION: Nexperia Zener Diode, 16V +/-2 %, +/-5 % 500 mW Through Hole 2-Pin SOD27 (DO-35); HEIGHT: mm; MANUFACTURER_NAME: Nexperia; MANUFACTURER_PART_NUMBER: BZX79-C16,113
Z3 Z4 = Dual Mono Amp Library:1N750: Zener Diodes Voltage Regulator Source: Datasheet <https://www.microsemi.com/document-portal/doc_view/10928-sa5-7-datasheet>; DESCRIPTION: Zener Diodes Voltage Regulator; HEIGHT: mm; MANUFACTURER_NAME: Microsemi Corporation; MANUFACTURER_PART_NUMBER: 1N750; MOUSER_PART_NUMBER: 494-1N750(DO-35); MOUSER_PRICE-STOCK: https://www.mouser.co.uk/ProductDetail/Microchip-Microsemi/1N750?qs=Xwz%252BGKGy4sB1rzIdx4SmVg%3D%3D

## Net classes
1 Signal: width 1.27 mm
2 Power: width 2.54 mm

## Board
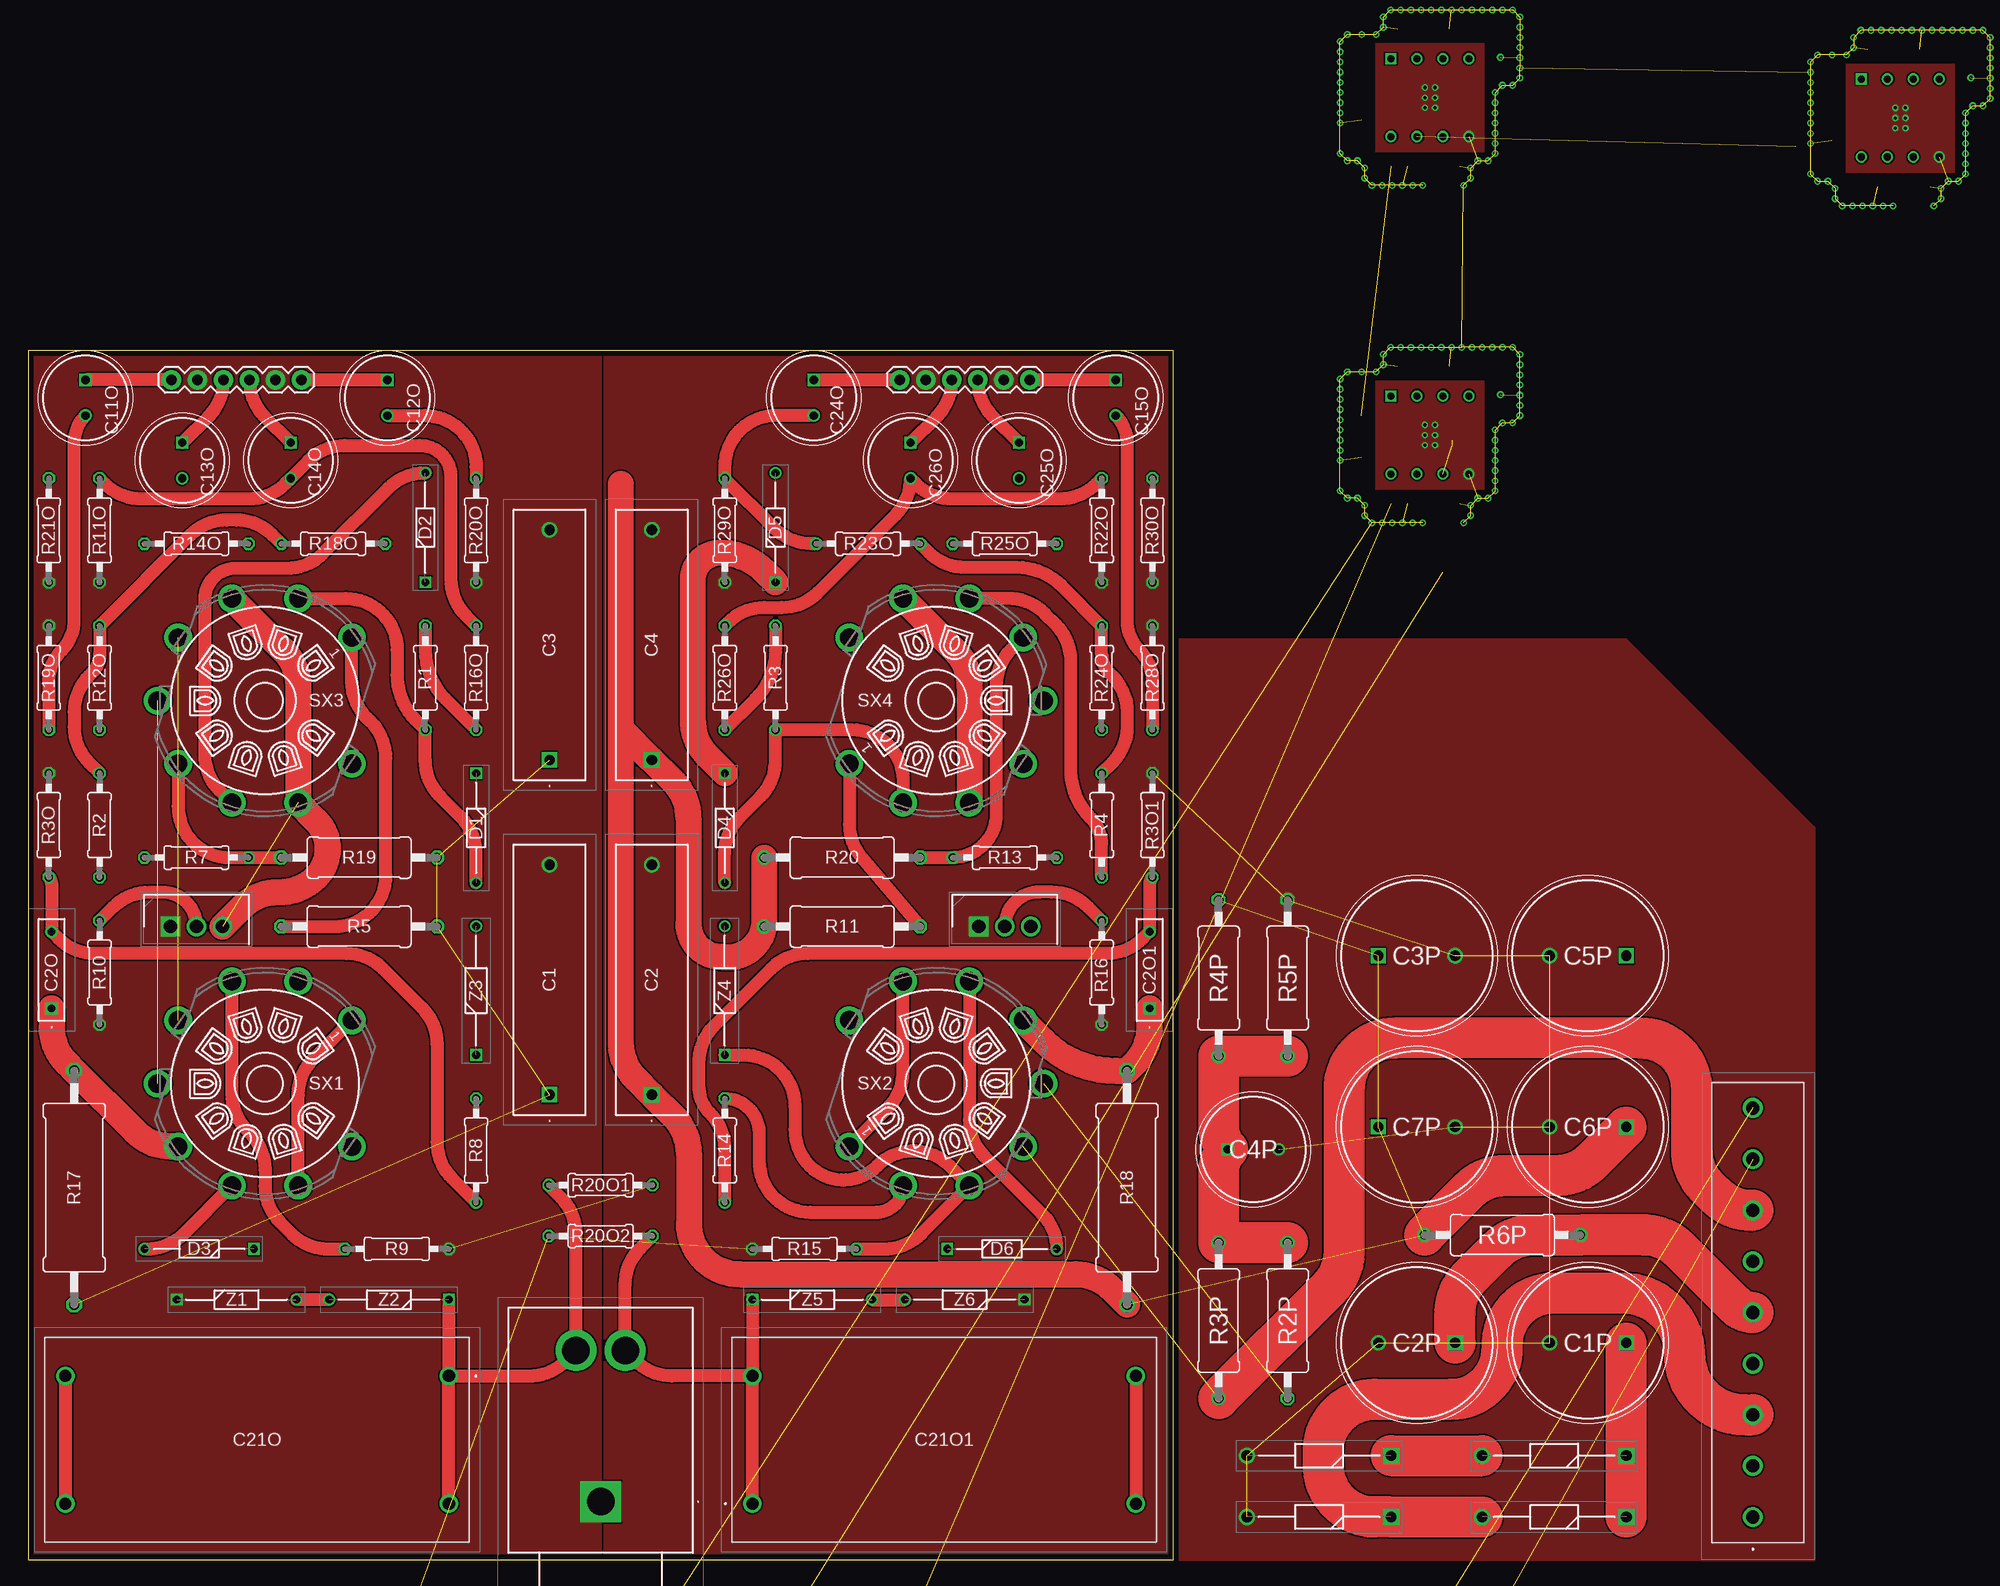
[diagram p2: board, top side]
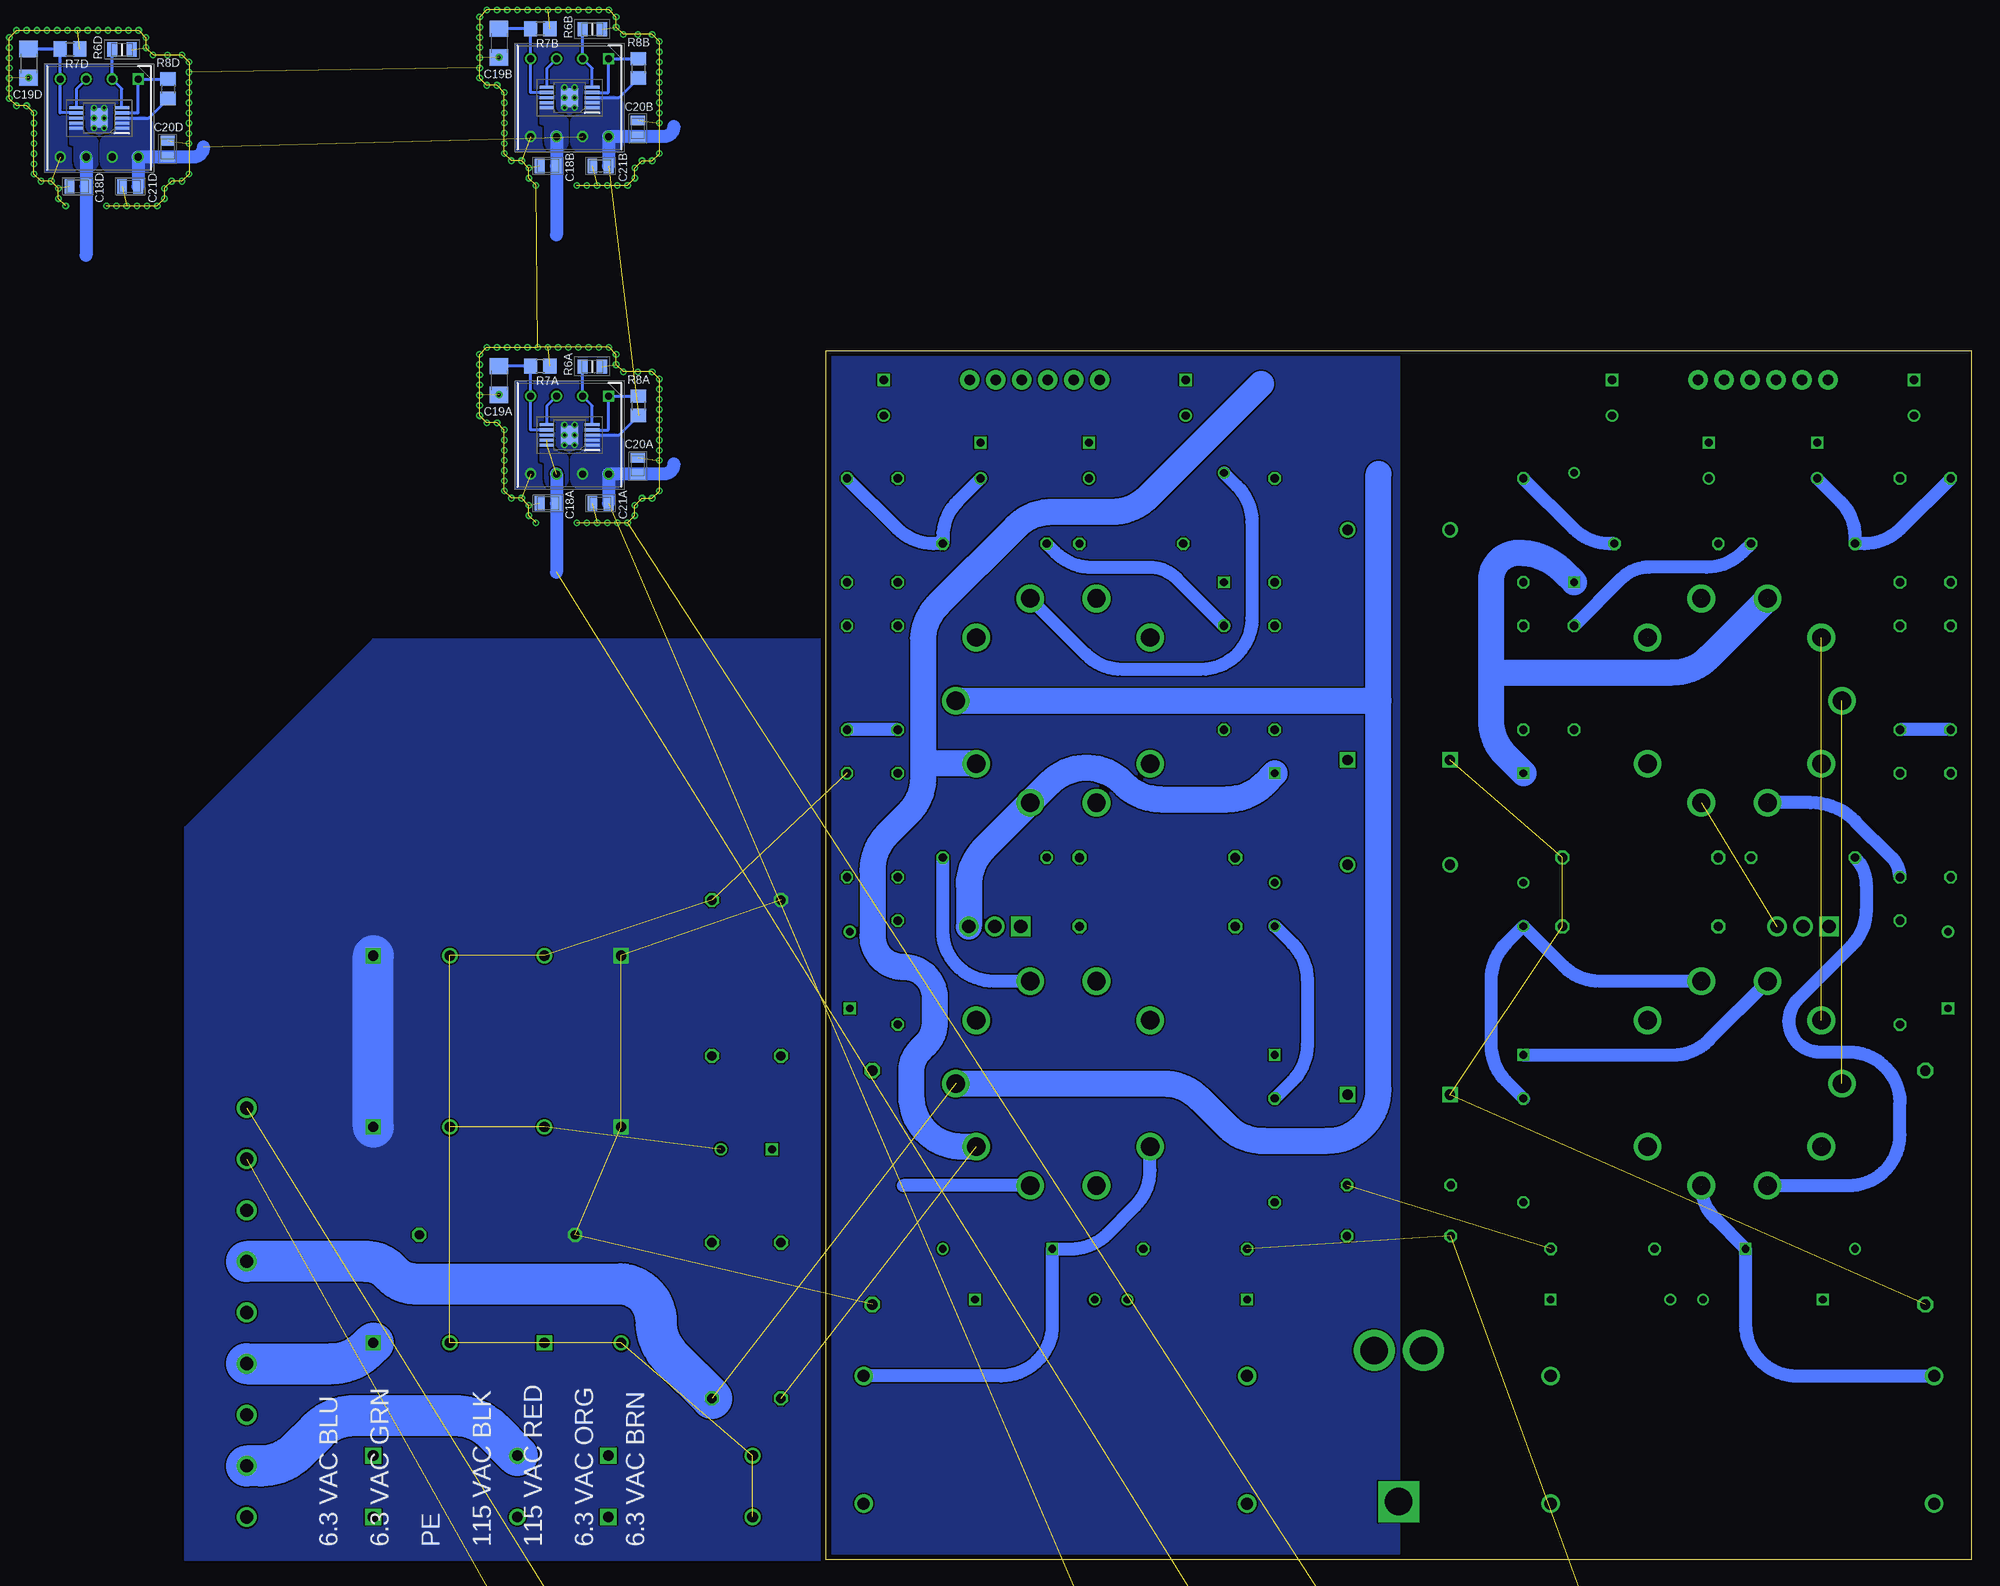
[diagram p3: board, bottom side, seen from below]

Size 112 x 118.3 mm. Coordinates in mm from the lower left corner, seen from the top.
Outline: 0,0 112,0 112,118.3 0,118.3 0,0
Copper layers (1*16): Top 0.035mm / dielectric 1.6mm / Bottom 0.035mm
Design rules "Elecrow_2-layer_PCB_eagle_rule": minimum track width 6mil, minimum drill 12mil, track to track 6mil, track to pad 6mil, pad to pad 6mil, via to via 8mil, smd to smd 0mil, copper to edge 20mil, drill to drill 10mil, minimum pad ring 6mil, minimum via ring 6mil, stop-mask expansion 0mil, vias tented up to drill 100mil, thermal gap 10mil

### Footprints (pad centres in the part's own frame; a part is rotated, then mirrored left to right if it is on the bottom)
MKP4G034705D00KSSD = drill 1 pad 1.5 square: 1 0,0 | drill 1 pad 1.5: 2 22.5,0
CAPPRD750W80D1475H4700 = drill 1 pad 1.5 square: 1 0,0 | drill 1 pad 1.5: 2 7.5,0
MKS4B031002A00JC00 = drill 0.7 pad 1.2 square: 1 0,0 | drill 0.7 pad 1.2: 2 7.5,0
CAPPRD500W60D1025H1750 = drill 0.8 pad 1.2 square: 1 0,0 | drill 0.8 pad 1.2: 2 5,0
CAPPRD350W60D825H1300 = drill 0.8 pad 1.2 square: 1 0,0 | drill 0.8 pad 1.2: 2 3.5,0
CAPC2013X140N = smd 0.96 x 1.44: 1 -0.82,0; 2 0.82,0
C1206 = smd 1.6 x 1.8: 1 -1.4,0; 2 1.4,0 | drill 0.35: DGND 1.4,0
CAPC2012X135N = smd 0.96 x 1.39: 1 -0.79,0; 2 0.79,0
DCP4G056007GD4KSSD = drill 1.2 pad 1.8: 1 0,0; 2 37.5,0; 3 37.5,12.5; 4 0,12.5
DIOAD1068W53L380D172 = drill 0.75 pad 1.15 square: 1 0,0 | drill 0.75 pad 1.15: 2 10.7,0
DIOAD1405W86L465D235 = drill 1.05 pad 1.575 square: 1 0,0 | drill 1.05 pad 1.575: 2 14.1,0
SOP50P490X110-11N = smd 1.425 x 0.3: 1 -2.212,1; 2 -2.212,0.5; 3 -2.212,0; 4 -2.212,-0.5; 5 -2.212,-1; 6 2.212,-1; 7 2.212,-0.5; 8 2.212,0; 9 2.212,0.5; 10 2.212,1 | smd 1.68 x 1.88: 11 0,0 | drill 0.305 pad 0.61: P$1 -0.498,0; P$2 0.498,0; P$3 -0.498,0.995; P$4 0.498,0.995; P$5 -0.498,-0.995; P$6 0.498,-0.995
SOT230P700X180-4N = smd 1.75 x 0.95: 1 -3.15,2.3; 2 -3.15,0; 3 -3.15,-2.3 | smd 1.75 x 3.2: 4 3.15,0
DIPS762W51P254L1016H390Q8N = drill 0.7 pad 1.1 square: 1 0,0 | drill 0.7 pad 1.1: 2 0,-2.54; 3 0,-5.08; 4 0,-7.62; 5 7.62,-7.62; 6 7.62,-5.08; 7 7.62,-2.54; 8 7.62,0
1X06 = drill 1.016 pad 1.88: 1 0,0; 2 2.54,0; 3 5.08,0; 4 7.62,0; 5 10.16,0; 6 12.7,0
SJ63033A = drill 2.69 pad 4.035 square: 1 0,0 | drill 2.69 pad 4.035: 2 14.8,-2.4; 3 14.8,2.4
1935239 = drill 1.3 pad 1.95: 1 0,0; 2 5,0; 3 10,0; 4 15,0; 5 20,0; 6 25,0; 7 30,0; 8 35,0; 9 40,0
SOT95P280X145-5N = smd 1.2 x 0.6: 1 -1.25,0.95; 2 -1.25,0; 3 -1.25,-0.95; 4 1.25,-0.95; 5 1.25,0.95 | drill 0.305 pad 0.61: DGND -1.25,0; DGND2 0,0; DGND3 1.25,0
0207/10 = drill 0.813 octagon: 1 -5.08,0; 2 5.08,0
0411/15 = drill 0.914 octagon: 1 -7.62,0; 2 7.62,0
RESC2012X60N = smd 1 x 1.4: 1 -0.95,0; 2 0.95,0
R0805 = smd 1.3 x 1.5: 1 -0.95,0; 2 0.95,0
0617/22 = drill 1.016 octagon: 1 -11.43,0; 2 11.43,0
SHORT_ALL-50 = drill 0.737 pad 1.524: 1 -0.635,0; 2 0.635,0
VT9-PT = drill 1.8 pad 2.4: 1 6.172,8.495; 2 0,10.5; 3 -6.172,8.495; 4 -9.986,3.245; 5 -9.986,-3.245; 6 -6.172,-8.495; 7 0,-10.5; 8 6.172,-8.495; 9 9.986,-3.244
TO254P482X997X2018-3P = drill 1.29 pad 1.935 square: 1 0,0 | drill 1.29 pad 1.935: 2 2.54,0; 3 5.08,0
DIOAD1165W56L425D185 = drill 0.75 pad 1.15 square: 1 0,0 | drill 0.75 pad 1.15: 2 11.7,0
DIOAD1256W56L444D203 = drill 0.75 pad 1.15 square: 1 0,0 | drill 0.75 pad 1.15: 2 12.6,0

### Placement (x,y rotation side)
C1  51,45.5 90 top
C1P  156.31,21.23 180 top  (outside the outline)
C1P1  5,-121 0 top  (outside the outline)
C2  61,45.5 90 top
C2O  2.3,53.95 90 top
C2O1  109.7,53.95 90 top
C2P  139.56,21.23 180 top  (outside the outline)
C2P1  21,-121 0 top  (outside the outline)
C3  51,78.25 90 top
C3P  132.06,59.1 0 top  (outside the outline)
C3P1  37,-121 0 top  (outside the outline)
C4  61,78.25 90 top
C4P  117.32,40.16 0 top  (outside the outline)
C5P  156.31,59.1 180 top  (outside the outline)
C5P1  5,-137 0 top  (outside the outline)
C6P  156.31,42.35 180 top  (outside the outline)
C6P1  21,-137 0 top  (outside the outline)
C7P  132.06,42.35 0 top  (outside the outline)
C7P1  37,-137 0 top  (outside the outline)
C11O  5.62,115.42 270 top
C12O  35.15,115.42 270 top
C13O  15.08,109.28 270 top
C14O  25.69,109.28 270 top
C15O  106.38,115.42 270 top
C18A  139.2,103.33 180 bottom  (outside the outline)
C18B  139.2,136.33 180 bottom  (outside the outline)
C18D  185.2,134.33 180 bottom  (outside the outline)
C19A  144.01,115.37 270 bottom  (outside the outline)
C19B  144.01,148.37 270 bottom  (outside the outline)
C19D  190.01,146.37 270 bottom  (outside the outline)
C20A  130.42,107.01 90 bottom  (outside the outline)
C20B  130.42,140.01 90 bottom  (outside the outline)
C20D  176.42,138.01 90 bottom  (outside the outline)
C21A  134.09,103.33 180 bottom  (outside the outline)
C21B  134.09,136.33 180 bottom  (outside the outline)
C21D  180.09,134.33 180 bottom  (outside the outline)
C21O  41.15,18 180 top
C21O1  70.85,5.5 0 top
C24O  76.85,115.42 270 top
C25O  96.92,109.28 270 top
C26A  13,-106 0 top  (outside the outline)
C26O  86.31,109.28 270 top
C27A  13,-109 0 top  (outside the outline)
C28A  13,-112 0 top  (outside the outline)
D1  43.83,76.95 270 top
D2  38.86,95.62 90 top
D3  22.1,30.42 180 top
D4  68.14,76.95 270 top
D5  73.11,95.62 90 top
D6  89.9,30.42 0 top
D7  133.31,10.2 180 top  (outside the outline)
D8  133.31,4.2 180 top  (outside the outline)
D9  156.31,4.2 180 top  (outside the outline)
D10  156.31,10.2 180 top  (outside the outline)
D11  6,-184 0 top  (outside the outline)
D12  27,-184 0 top  (outside the outline)
D13  6,-188 0 top  (outside the outline)
D14  27,-188 0 top  (outside the outline)
IC1  183.11,141.03 180 bottom  (outside the outline)
IC2  137.11,110.03 180 bottom  (outside the outline)
IC3  5,-194 0 top  (outside the outline)
IC5  137.11,143.03 180 bottom  (outside the outline)
J1  179.3,144.84 270 bottom  (outside the outline)
J2  85.26,115.42 0 top
J3  56,5.7 90 top
J4  168.69,4.2 90 top  (outside the outline)
J5  133.3,113.84 270 bottom  (outside the outline)
J13  26.74,115.42 180 top
J17  133.3,146.84 270 bottom  (outside the outline)
LDO7  7,-103 0 top  (outside the outline)
R1  38.86,86.28 90 top
R2  7,71.87 90 top
R2P  123.19,23.41 270 top  (outside the outline)
R3  73.11,86.28 90 top
R3O  2.03,71.87 90 top
R3O1  109.97,71.87 90 top
R3P  116.44,23.41 90 top  (outside the outline)
R4  105,71.87 90 top
R4P  116.44,56.91 90 top  (outside the outline)
R5  32.38,61.95 0 top
R5P  123.19,56.91 270 top  (outside the outline)
R6A  134.89,116.72 0 bottom  (outside the outline)
R6B  134.89,149.72 0 bottom  (outside the outline)
R6D  180.89,147.72 0 bottom  (outside the outline)
R6P  144.19,31.79 0 top  (outside the outline)
R6P1  26,-180 0 top  (outside the outline)
R7  16.48,68.7 0 top
R7A  139.97,116.77 0 bottom  (outside the outline)
R7B  139.97,149.77 0 bottom  (outside the outline)
R7D  185.97,147.77 0 bottom  (outside the outline)
R8  43.83,40.05 270 top
R8A  130.37,112.89 90 bottom  (outside the outline)
R8B  130.37,145.89 90 bottom  (outside the outline)
R8D  176.37,143.89 90 bottom  (outside the outline)
R9  36.07,30.42 180 top
R10  7,57.45 90 top
R11  79.62,61.95 180 top
R11O  7,100.7 270 top
R12O  7,86.28 270 top
R13  95.52,68.7 180 top
R14  68.14,40.05 270 top
R14O  16.48,99.4 180 top
R15  75.93,30.42 0 top
R16  105,57.45 90 top
R16O  43.83,86.28 90 top
R17  4.52,36.42 90 top
R18  107.48,36.42 270 top
R18O  29.84,99.4 0 top
R19  32.38,68.7 0 top
R19O  2.03,86.28 270 top
R20  79.62,68.7 0 top
R20O  43.83,100.7 270 top
R20O1  56,36.65 180 top
R20O2  56,31.68 0 top
R21O  2.03,100.7 90 top
R22O  105,100.7 270 top
R23O  82.16,99.4 180 top
R24O  105,86.28 270 top
R25O  95.52,99.4 0 top
R26O  68.14,86.28 90 top
R28O  109.97,86.28 270 top
R29O  68.14,100.7 270 top
R30O  109.97,100.7 90 top
SH2  3,-98 0 top  (outside the outline)
SX1  23.18,46.6 342 top
SX2  88.82,46.6 162 top
SX3  23.18,84.05 342 top
SX4  88.82,84.05 162 top
U1  13.94,61.95 0 top
U2  92.98,61.95 0 top
Z1  14.55,25.45 0 top
Z2  41.15,25.45 180 top
Z3  43.83,49.39 90 top
Z4  68.14,49.39 90 top
Z5  70.85,25.45 0 top
Z6  97.45,25.45 180 top

### Tracks (layer width: path | path; a pad name or v marks a point on that pad's centre or on a via)
6.3_VAC_BLU/2  (2 unrouted)
6.3_VAC_GRN/2  (2 unrouted)
66.3VAC/BRN/1  (1 unrouted)
66.3VAC/BRN/2  (1 unrouted)
  Top 4: J4.7 168.56,34.2 arc-45 165.02,35.66 164.15,36.54 arc-45 162.69,40.07 162.69,46.05 arc90 157.69,51.05 133.7,51.05 arc90 128.7,46.05 128.7,30.12 arc-45 127.24,26.59 R3P.1
  Bottom 2.54: 69.46,115.04 80.54,103.96 arc45 84.07,102.5 89.93,102.5 arc-45 93.46,101.04 101.06,93.44 arc-45 102.53,89.9 102.53,77.88 | 102.53,77.88 102.53,76.55 arc45 103.99,73.01 106.02,70.98 arc-45 107.48,67.44 107.48,61 arc-90 104.48,58 104.4,58 arc90 101.4,55 101.4,52.54 arc45 102.28,50.42 102.82,49.88 arc-45 103.7,47.76 103.7,45.43 arc-90 98.7,40.43 SX2.4 | SX4.4 102.53,77.88
66.3VAC/ORG/1  (1 unrouted)
66.3VAC/ORG/2  (1 unrouted)
  Bottom 2.54: SX4.5 58,84.05 | SX2.5 79.05,46.6 arc45 75.51,45.14 72.83,42.45 arc-45 69.29,40.99 63,40.99 arc-90 58,45.99 58,84.05 | 58,84.05 58,106.25
  Bottom 4: R2P.2 127.16,19.77 arc45 128.63,23.3 arc-90 132.32,27 152.2,27 arc45 154.4,27.91 154.78,28.29 arc-45 156.97,29.2 J4.6
115_VAC_BLK/2
  Top 4: D7.1 D10.2
  Bottom 4: D10.2 144.65,12.64 arc-45 148.19,14.1 158.23,14.1 arc-45 161.76,12.64 163.74,10.66 arc45 167.27,9.2 J4.2
115_VAC_RED/2
  Top 4: D9.2 D8.1 131.69,4.2 arc-90 126.69,9.2 126.69,10.71 arc-90 131.69,15.71 139.19,15.71 arc90 144.19,20.71 144.19,21.1 arc-90 149.19,26.1 156,26.1 arc-90 162,20.1 arc90 167.9,14.2 J4.3
+3V3  (5 unrouted)
  Bottom 1.272: J5.6 C18A.1 138.38,96.61
+5V/1
  Bottom 1.272: J1.6 C18D.1 184.38,127.61
  pour Bottom (no thermals): 184.61,140.7 186.04,140.7 186.04,138.59 arc-90 185.81,138.36 arc90 185.58,138.13 185.58,136.7 arc-90 184.58,135.7 184.19,135.7 arc-90 183.19,136.7 183.19,138.64 arc-90 183.9,139.36 arc90 184.61,140.07
+5V/2
  Bottom 1.272: J17.6 C18B.1 138.38,129.61
  pour Bottom (no thermals): 138.61,142.7 140.04,142.7 140.04,140.59 arc-90 139.81,140.36 arc90 139.58,140.13 139.58,138.7 arc-90 138.58,137.7 138.19,137.7 arc-90 137.19,138.7 137.19,140.64 arc-90 137.9,141.36 arc90 138.61,142.07
+5V/3
  pour Bottom (no thermals): 138.61,109.7 140.04,109.7 140.04,107.59 arc-90 139.81,107.36 arc90 139.58,107.13 139.58,105.7 arc-90 138.58,104.7 138.19,104.7 arc-90 137.19,105.7 137.19,107.64 arc-90 137.9,108.36 arc90 138.61,109.07
+240VDC/1  (4 unrouted)
+240VDC/2  (4 unrouted)
  Top 2.54: R20.1 R11.2 arc-90 67.8,59 arc-90 64.59,62.21 64.59,72.59 arc45 63.12,76.13 C4.1 58,81.25 | R18.2 106,26.48 arc45 102.46,27.94 69.63,27.94 arc-90 64.63,32.94 64.63,39.8 arc45 63.16,43.34 C2.1 59.46,47.04 arc-45 58,50.57 58,81.25 | 58,81.25 58,105.25
  Top 4: R6P.1 140.91,36.14 arc-45 144.45,37.6 149.49,37.6 arc45 153.03,39.06 C6P.1
  Bottom 4: C6P.1 C5P.1
  pour Bottom (no thermals): 174.69,0 112,0 112,90 156.31,90 174.69,71.62
AGND/1  (1 unrouted)
  pour Top (rank 5, no thermals): 0,0 56,0 56,118.3 0,118.3
AGND/2  (12 unrouted)
  pour Top (rank 5, no thermals): 174.69,0 112,0 112,90 156.31,90 174.69,71.62
  pour Top (rank 6, no thermals): 56,0 112,0 112,118.3 56,118.3
DGND  (5 unrouted)
DGND/2  (via drill 0.35)  (206 unrouted)
  other vias: 131.84,149.2 132.55,149.91 128.32,140.54 128.32,141.53 128.32,145.51 128.32,144.52 128.32,143.52 128.32,142.53 128.32,146.51 128.32,147.51 128.32,148.5 129.03,149.2 130.44,149.2 134.25,151.61 133.25,151.61 132.55,150.9 135.24,151.61 136.24,151.61 137.23,151.61 138.23,151.61 139.22,151.61 140.22,151.61 141.21,151.61 142.21,151.61 143.2,151.61 141.8,136.85 141.09,136.14 145.9,145.93 145.9,144.93 145.2,144.23 144.2,144.23 143.5,140.54 143.5,141.53 143.5,142.53 143.5,143.52 145.2,151.61 145.9,150.9 145.9,149.91 145.9,148.91 145.9,147.92 145.9,146.92 144.2,151.61 143.5,139.54 143.5,138.55 143.5,137.55 142.79,136.85 133.42,134.44 140.39,134.44 141.09,135.15 136.41,134.44 135.41,134.44 134.42,134.44 132.43,134.44 131.43,134.44 130.73,135.15 130.73,136.14 130.02,136.85 128.32,137.55 129.03,136.85 177.84,147.2 178.55,147.91 174.32,138.54 174.32,139.53 174.32,143.51 174.32,142.52 174.32,141.52 174.32,140.53 174.32,144.51 174.32,145.51 174.32,146.5 175.03,147.2 176.44,147.2 180.25,149.61 179.25,149.61 178.55,148.9 181.24,149.61 182.24,149.61 183.23,149.61 184.23,149.61 185.22,149.61 186.22,149.61 187.21,149.61 188.21,149.61 189.2,149.61 187.8,134.85 187.09,134.14 191.9,143.93 191.9,142.93 191.2,142.23 190.2,142.23 189.5,138.54 189.5,139.53 189.5,140.53 189.5,141.52 191.2,149.61 191.9,148.9 191.9,147.91 191.9,146.91 191.9,145.92 191.9,144.92 190.2,149.61 189.5,137.54 189.5,136.55 189.5,135.55 188.79,134.85 179.42,132.44 186.39,132.44 187.09,133.15 182.41,132.44 181.41,132.44 180.42,132.44 178.43,132.44 177.43,132.44 176.73,133.15 176.73,134.14 176.02,134.85 174.32,135.55 175.03,134.85 131.84,116.2 132.55,116.91 128.32,107.54 128.32,108.53 128.32,112.51 128.32,111.52 128.32,110.52 128.32,109.53 128.32,113.51 128.32,114.51 128.32,115.5 129.03,116.2 130.44,116.2 134.25,118.61 133.25,118.61 132.55,117.9 135.24,118.61 136.24,118.61 137.23,118.61 138.23,118.61 139.22,118.61 140.22,118.61 141.21,118.61 142.21,118.61 143.2,118.61 141.8,103.85 141.09,103.14 145.9,112.93 145.9,111.93 145.2,111.23 144.2,111.23 143.5,107.54 143.5,108.53 143.5,109.53 143.5,110.52 145.2,118.61 145.9,117.9 145.9,116.91 145.9,115.91 145.9,114.92 145.9,113.92 144.2,118.61 143.5,106.54 143.5,105.55 143.5,104.55 142.79,103.85 133.42,101.44 140.39,101.44 141.09,102.15 136.41,101.44 135.41,101.44 134.42,101.44 132.43,101.44 131.43,101.44 130.73,102.15 130.73,103.14 130.02,103.85 128.32,104.55 129.03,103.85
  pour Top (no thermals): 131.78,115.36 131.78,104.7 142.44,104.7 142.44,115.36
  pour Bottom (rank 6, no thermals): 56,0 112,0 112,118.3 56,118.3
  pour Bottom (rank 6, no thermals): 131.78,148.36 142.44,148.36 142.44,137.7 131.78,137.7
  pour Top (no thermals): 131.78,148.36 131.78,137.7 142.44,137.7 142.44,148.36
  pour Bottom (rank 6, no thermals): 177.78,146.36 188.44,146.36 188.44,135.7 177.78,135.7
  pour Top (no thermals): 177.78,146.36 177.78,135.7 188.44,135.7 188.44,146.36
  pour Bottom (rank 6, no thermals): 131.78,115.36 142.44,115.36 142.44,104.7 131.78,104.7
L+
  Top 1.27: R23O.1 88.08,98.56 arc45 91.61,97.1 96.69,97.1 arc-45 101.08,95.28 R24O.1 105,88.59 arc45 105.77,86.73 106.02,86.48 arc-45 107.48,82.94 107.48,81.5 arc-45 106.02,77.97 R4.2
L-
  Top 1.27: R3.2 73.11,88.95 arc-45 71.14,84.21 R26O.1
  Bottom 1.27: R25O.1 89.61,98.56 arc-45 86.07,97.1 80.42,97.1 arc45 77.73,95.99 R3.2
L_OUT
  Top 1.27: R20O2.2 59.86,30.46 arc45 58.4,26.93 J3.2 59.44,19.46 arc45 62.97,18 C21O1.4 | C21O1.1 C21O1.4 | Z5.1 C21O1.4
N$1  (1 unrouted)
  Top 1.27: R19.1 R7.2 19.68,68.7 arc-90 14.68,73.7 SX3.6
N$2  (1 unrouted)
  Bottom 1.27: SX1.2 36.35,56.59 arc45 39.89,58.05 Z3.2 45.54,60.28 arc-45 47,56.74 47,50.38 arc-45 45.54,46.84 R8.1
N$3
  Top 1.27: SX2.1 84.11,44.22 arc45 85.58,47.75 SX2.8 | C21O1.3 C21O1.2
  Bottom 1.27: C21O1.3 94.91,18 arc-90 89.91,23 D6.1 88.05,30.42 arc-45 84.51,31.89 81.79,34.61 arc-45 80.33,38.14 SX2.1
N$4
  Top 1.27: SX4.2 85.58,76.2 arc90 80.58,81.2 R3.1 73.11,78.22 arc-45 71.64,74.68 69.6,72.64 arc45 68.14,69.1 D4.2
N$5
  Top 1.27: R4.1 105,70.04 arc45 103.96,72.54 arc-45 102,77.28 102,87.93 arc45 100.54,91.46 99.43,92.57 arc45 95.89,94.03 SX4.7
  Bottom 1.27: D5.2 71.84,105.05 arc45 70.37,101.51 70.37,92.1 arc90 75.37,87.1 83.06,87.1 arc45 86.6,88.56 SX4.7
N$6  (1 unrouted)
  Top 1.27: SX3.2 31.1,94.03 arc-90 36.1,89.03 36.1,86.53 arc45 37.92,82.14 R1.1 38.86,78.22 arc45 40.32,74.68 42.36,72.64 arc-45 43.83,69.1 D1.2
N$7
  Top 2.54: D5.1 72.05,96.68 arc45 67.66,98.5 arc90 65,95.84 65,82.16 arc45 66.46,78.62 D4.1 | SX4.8 90.6,89.01 arc-45 92.07,85.47 SX4.3
  Bottom 2.54: D4.1 69.22,75.86 arc45 72.76,74.4 79.33,74.4 arc45 82.86,75.86 83.03,76.03 arc-90 90.1,76.03 SX4.3 96.6,69.53 arc-45 98.06,65.99 U2.3
N$8
  Top 1.27: SX4.1 80.33,71.95 arc40 81.51,68.72 R11.1
N$9
  Top 1.27: R20.2 R13.2 arc90 94.69,72.94 94.69,85.52 arc-45 96.16,89.06 SX4.6
N$10
  Top 1.27: J13.6 C11O.1
N$11
  Top 1.27: R19O.2 2.03,85.91 arc-45 3.3,88.97 arc45 4.52,91.91 4.52,109.25 arc-45 C11O.2
  Bottom 1.27: R19O.2 R12O.2
N$12
  Top 1.27: J2.6 C15O.1
N$13  (2 unrouted)
  Top 1.27: D2.2 38.79,106.32 arc45 35.26,104.86 28.86,98.46 arc-45 25.33,97 20.31,97 arc90 17.31,94 17.31,78.76 arc45 18.77,75.22 SX3.7
  Bottom 1.27: R2.1 arc-45 7.79,68.69 11.34,72.25 arc-45 15.73,74.06 SX3.7
N$14
  Top 1.27: R14.1 arc-90 71.5,41.77 71.5,39 arc90 76.5,34 82.96,34 arc90 SX2.2
  Bottom 1.27: Z4.2 66.43,60.28 arc45 64.96,56.74 64.96,50.38 arc45 66.43,46.84 R14.1
N$15
  Top 1.27: J13.1 C12O.1
N$16
  Top 1.27: R8.2 41.46,37.33 arc-45 40,40.87 40,50.46 arc45 38.54,53.99 34.69,57.84 arc45 31.16,59.3 6.52,59.3 arc-45 2.98,60.76 C2O.2 2.3,66.14 arc45 R3O.1
N$17
  Top 1.27: R3O1.1 arc45 109.7,66.14 C2O1.2 109.02,60.76 arc-45 105.48,59.3 76.24,59.3 arc45 72.71,57.84 67.06,52.19 arc45 65.6,48.66 65.6,46.32 arc45 66.67,43.73 arc-45 68.14,40.19 R14.2
N$18  (3 unrouted)
  Top 1.27: SX1.8 26.42,45.45 arc-45 27.89,48.99 SX1.1 | C21O.2 C21O.3
  Bottom 1.27: C21O.2 17.09,18 arc90 22.09,23 D3.1 25.1,33.43 arc45 SX1.8
N$19
  Top 1.27: C12O.2 38.83,111.92 arc-90 43.83,106.92 R20O.1
  Bottom 1.27: R18O.2 35.37,99.4 arc45 38.91,100.86 R20O.1
N$20
  Top 1.27: R28O.2 109.97,85.91 arc45 108.7,88.97 arc-45 107.48,91.91 107.48,109.25 arc45 C15O.2
  Bottom 1.27: R24O.2 R28O.2
N$21
  Top 1.27: J13.4 19.12,115.38 arc-45 17.65,111.85 C13O.1
N$22  (3 unrouted)
  Top 2.54: U1.3 20.92,63.86 arc-45 24.46,65.33 24.65,65.33 arc45 28.19,66.79 arc90 28.19,72.3 SX3.8 26.42,85.47 arc45 24.96,89.01 SX3.3
  Bottom 2.54: D2.1 39.92,96.68 arc-45 44.31,98.5 arc-90 47,95.81 47,86.8 | 47,86.8 47,82.19 arc-45 45.54,78.66 D1.1 | 47,86.8 29.24,86.8 arc-45 25.7,88.26 SX3.3
N$23  (2 unrouted)
  Top 1.27: D3.2 11.67,30.42 arc45 15.21,31.89 SX1.7
  Bottom 1.27: R7.1 arc45 10.3,66.05 10.3,63.57 arc45 11.76,60.04 16.99,54.81 arc-135 14.87,49.69 12,49.69 arc90 7,44.69 7,41.62 arc90 12,36.62 SX1.7
N$24
  Top 1.27: J13.3 21.66,115.38 arc45 23.12,111.85 C14O.1
N$25
  Top 1.27: R11O.1 7.52,105.26 arc45 11.05,103.8 21.64,103.8 arc45 25.17,105.26 C14O.2 27.45,107.54 arc-45 30.98,109 38.34,109 arc-90 41.34,106 41.34,95.92 arc45 42.8,92.38 R16O.2
N$26  (2 unrouted)
  Top 1.27: SX1.3 19.93,45.58 arc45 21.4,42.04 21.71,41.72 arc-45 23.18,38.19 23.18,36.57 arc45 24.64,33.04 25.79,31.89 arc45 29.32,30.42 R9.2
  Bottom 1.27: Z3.1 29.2,49.39 arc-45 25.67,50.85 SX1.3
N$27
  Top 1.27: Z4.1 70,49.39 arc-90 75,44.39 75,42.07 arc45 76.46,38.54 arc90 83.04,38.54 83.06,38.56 arc-90 90.13,38.56 SX2.3 87.34,31.89 arc-45 83.8,30.42 R15.2
  Bottom 1.27: SX2.3 104.47,36.62
N$28
  Bottom 1.27: C13O.2 12.86,103.56 arc45 11.4,100.02 R14O.2 10.48,99.4 arc-45 6.95,100.86 R21O.2
N$29
  Top 1.27: SX2.7 92.07,43 arc45 93.53,39.47 99.21,33.79 arc-45 D6.2
  Bottom 1.27: SX2.7 95.6,56.59 arc90 100.6,61.59 R13.1
N$30
  Top 1.27: C24O.1 J2.1
N$31
  Top 1.27: R23O.2 76.59,99.4 arc-45 73.06,100.86 R29O.1 68.14,106.92 arc-90 73.14,111.92 C24O.2
N$32
  Top 1.27: J2.4 92.88,115.38 arc45 94.35,111.85 C25O.1
N$33
  Top 1.27: J2.3 90.34,115.38 arc-45 88.88,111.85 C26O.1
N$34
  Top 1.27: R26O.2 68.48,91.7 arc-45 72.01,93.17 73.72,93.17 arc45 77.26,94.63 84.85,102.22 arc45 86.31,105.75 C26O.2 86.83,105.26 arc45 90.36,103.8 100.95,103.8 arc45 104.48,105.26 R22O.1
N$35  (1 unrouted)
  Top 1.27: SX3.1 31.67,85.9 arc45 33.14,82.36 33.54,81.96 arc-45 35,78.43 35,66.95 arc-90 30,61.95 R5.1
N$36
  Bottom 1.27: C25O.2 99.14,103.56 arc-45 100.6,100.02 R25O.2 101.52,99.4 arc45 105.05,100.86 R30O.2
N$37
  Top 1.27: R10.2 8.33,63.86 arc-45 11.87,65.33 13.1,65.33 arc-90 U1.2
N$38
  Top 1.27: R16.2 103.67,63.86 arc45 100.13,65.33 98.9,65.33 arc90 U2.2
N$39  (1 unrouted)
  Top 2.54: C2O.1 2.3,52.13 arc45 3.76,48.6 R17.2 10.47,41.89 arc45 14,40.43 SX1.6
N$40
  Top 2.54: C2O1.1 109.7,52.13 arc-45 108.24,48.6 R18.1 106.39,47.84 arc-45 99.32,50.77 SX2.6
N$41
  Top 1.27: Z2.2 Z1.2
N$42
  Top 1.27: Z5.2 Z6.2
N$43
  Top 4: C1P.1 D10.1 D9.1
  Bottom 4: J4.4 160.42,19.2 arc-45 156.88,20.66 C1P.1
N$44
  Top 4: C2P.1 139.56,24.16 arc-45 141.03,27.69 143.66,30.33 arc-45 147.19,31.79 R6P.2 158.03,31.79 arc-45 161.56,30.33 166.98,24.91 arc45 J4.5
N$45
  Top 4: R5P.2 R4P.1 116.44,42.27 arc45 C4P.1 arc45 116.44,38.06 R3P.2 R2P.1
N$46
  Bottom 0.305: IC5.4 133.3,143.53 J17.1 R8B.2
N$47
  Bottom 0.305: R6B.1 J17.2 134.9,145.89 IC5.5
N$48
  Bottom 0.305: IC5.6 139.32,145.89 J17.3
N$49
  Bottom 0.305: IC1.4 179.3,141.53 J1.1 R8D.2
N$50
  Bottom 0.305: R6D.1 J1.2 180.9,143.89 IC1.5
N$51
  Bottom 0.305: IC1.6 185.32,143.89 J1.3
N$52
  Bottom 0.305: C19D.1 R7D.1 J1.4 186.92,141.53 IC1.7
N$53
  Bottom 0.305: IC2.4 133.3,110.53 J5.1 R8A.2
N$54
  Bottom 0.305: R6A.1 J5.2 134.9,112.89 IC2.5
N$55
  Bottom 0.305: IC2.6 139.32,112.89 J5.3
N$56
  Bottom 0.305: C19A.1 R7A.1 J5.4 140.92,110.53 IC2.7
N$57  (2 unrouted)
N$58  (1 unrouted)
N$65  (2 unrouted)
N$103
  Bottom 0.305: C19B.1 R7B.1 J17.4 140.92,143.53 IC5.7
R+
  Top 1.27: R2.2 5.98,77.97 arc-45 4.52,81.5 4.52,82.94 arc-45 5.98,86.48 6.23,86.73 arc45 7,88.59 R12O.1 15.87,100.24 arc-45 19.41,101.7 20.39,101.7 arc-45 23.92,100.24 R18O.1
R-
  Top 1.27: R1.2 38.86,88.95 arc45 40.82,84.21 R16O.1
  Bottom 1.27: R14O.1 22.39,98.56 arc45 25.93,97.1 31.55,97.1 arc-45 34.23,95.99 R1.2
R_OUT
  Top 1.27: R20O1.2 52.14,35.43 arc-45 53.6,31.9 J3.3 52.56,19.46 arc-45 49.03,18 C21O.1 | C21O.4 C21O.1 | Z2.1 C21O.1
VCC/2  (7 unrouted)
  Bottom 0.305: IC1.3 178.28,141.03 R8D.1 | IC2.3 132.28,110.03 R8A.1 | IC5.3 132.28,143.03 R8B.1
  Bottom 1.272: 172.9,138.22 arc90 173.9,137.22 C20D.1 J1.8 C21D.1 | 126.9,107.22 arc90 127.9,106.22 C20A.1 J5.8 C21A.1 | 126.9,140.22 arc90 127.9,139.22 C20B.1 J17.8 C21B.1
  pour Bottom (no thermals): 181.61,141.2 178.78,141.2 arc90 177.78,140.2 177.78,136.7 arc90 178.78,135.7 182.04,135.7 arc90 183.04,136.7 183.04,138.64 arc90 182.32,139.36 arc-90 181.61,140.07
  pour Bottom (no thermals): 135.61,110.2 132.78,110.2 arc90 131.78,109.2 131.78,105.7 arc90 132.78,104.7 136.04,104.7 arc90 137.04,105.7 137.04,107.64 arc90 136.32,108.36 arc-90 135.61,109.07
  pour Bottom (no thermals): 135.61,143.2 132.78,143.2 arc90 131.78,142.2 131.78,138.7 arc90 132.78,137.7 136.04,137.7 arc90 137.04,138.7 137.04,140.64 arc90 136.32,141.36 arc-90 135.61,142.07

### Text on the board
bNames: 6.3 VAC BRN | 6.3 VAC ORG | 115 VAC RED | 115 VAC BLK | PE | 6.3 VAC GRN | 6.3 VAC BLU